# EAGLE schematic Schematic3 (EAGLE 6.5.0)
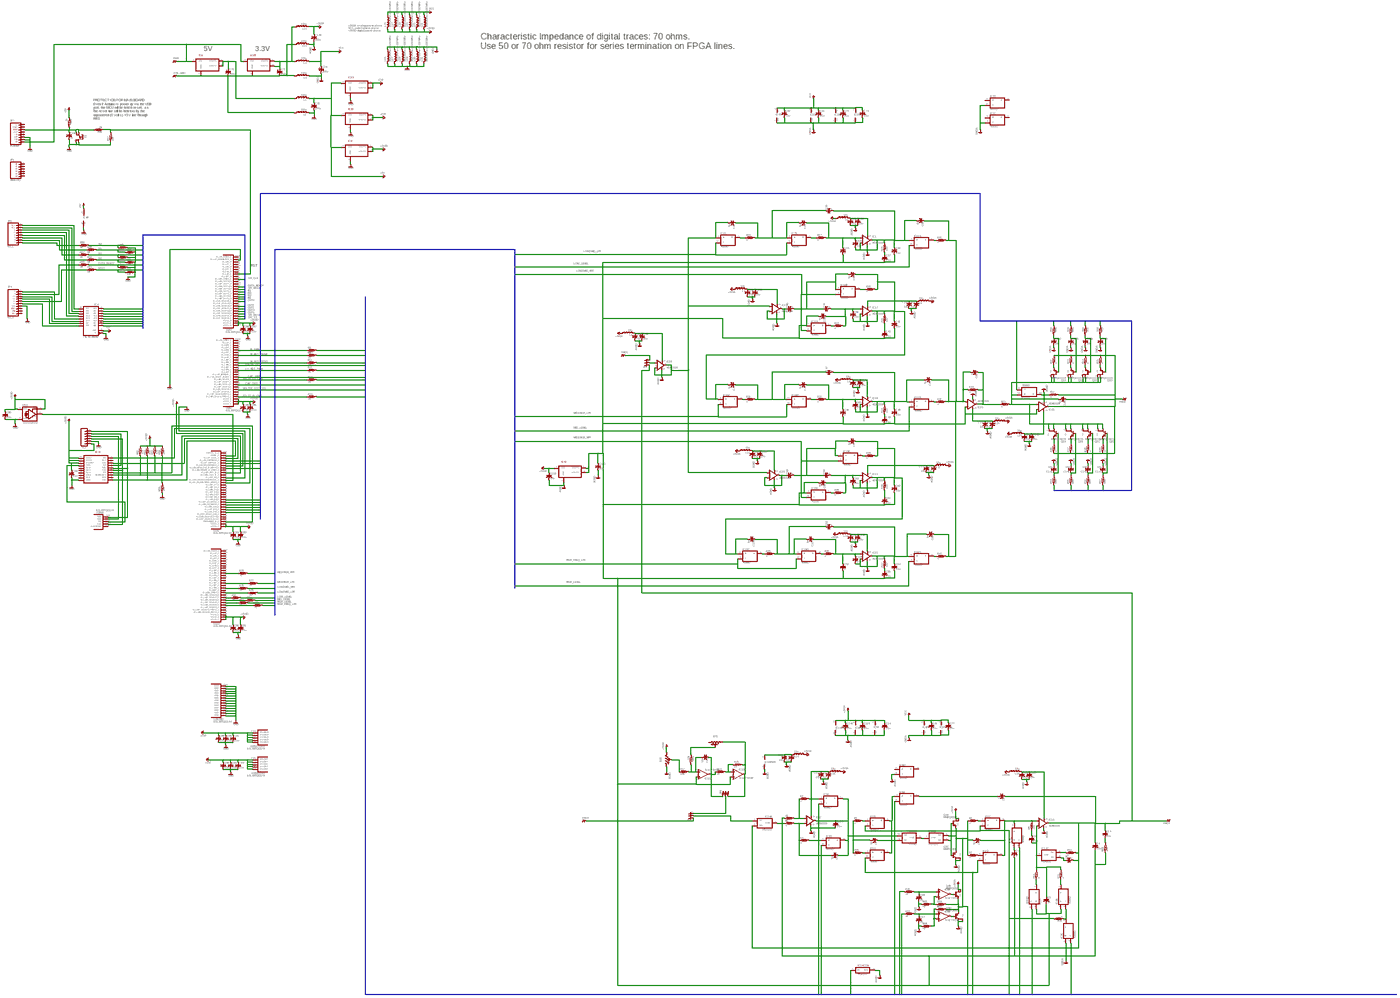
[diagram p0: schematic, sheet 1, overview]
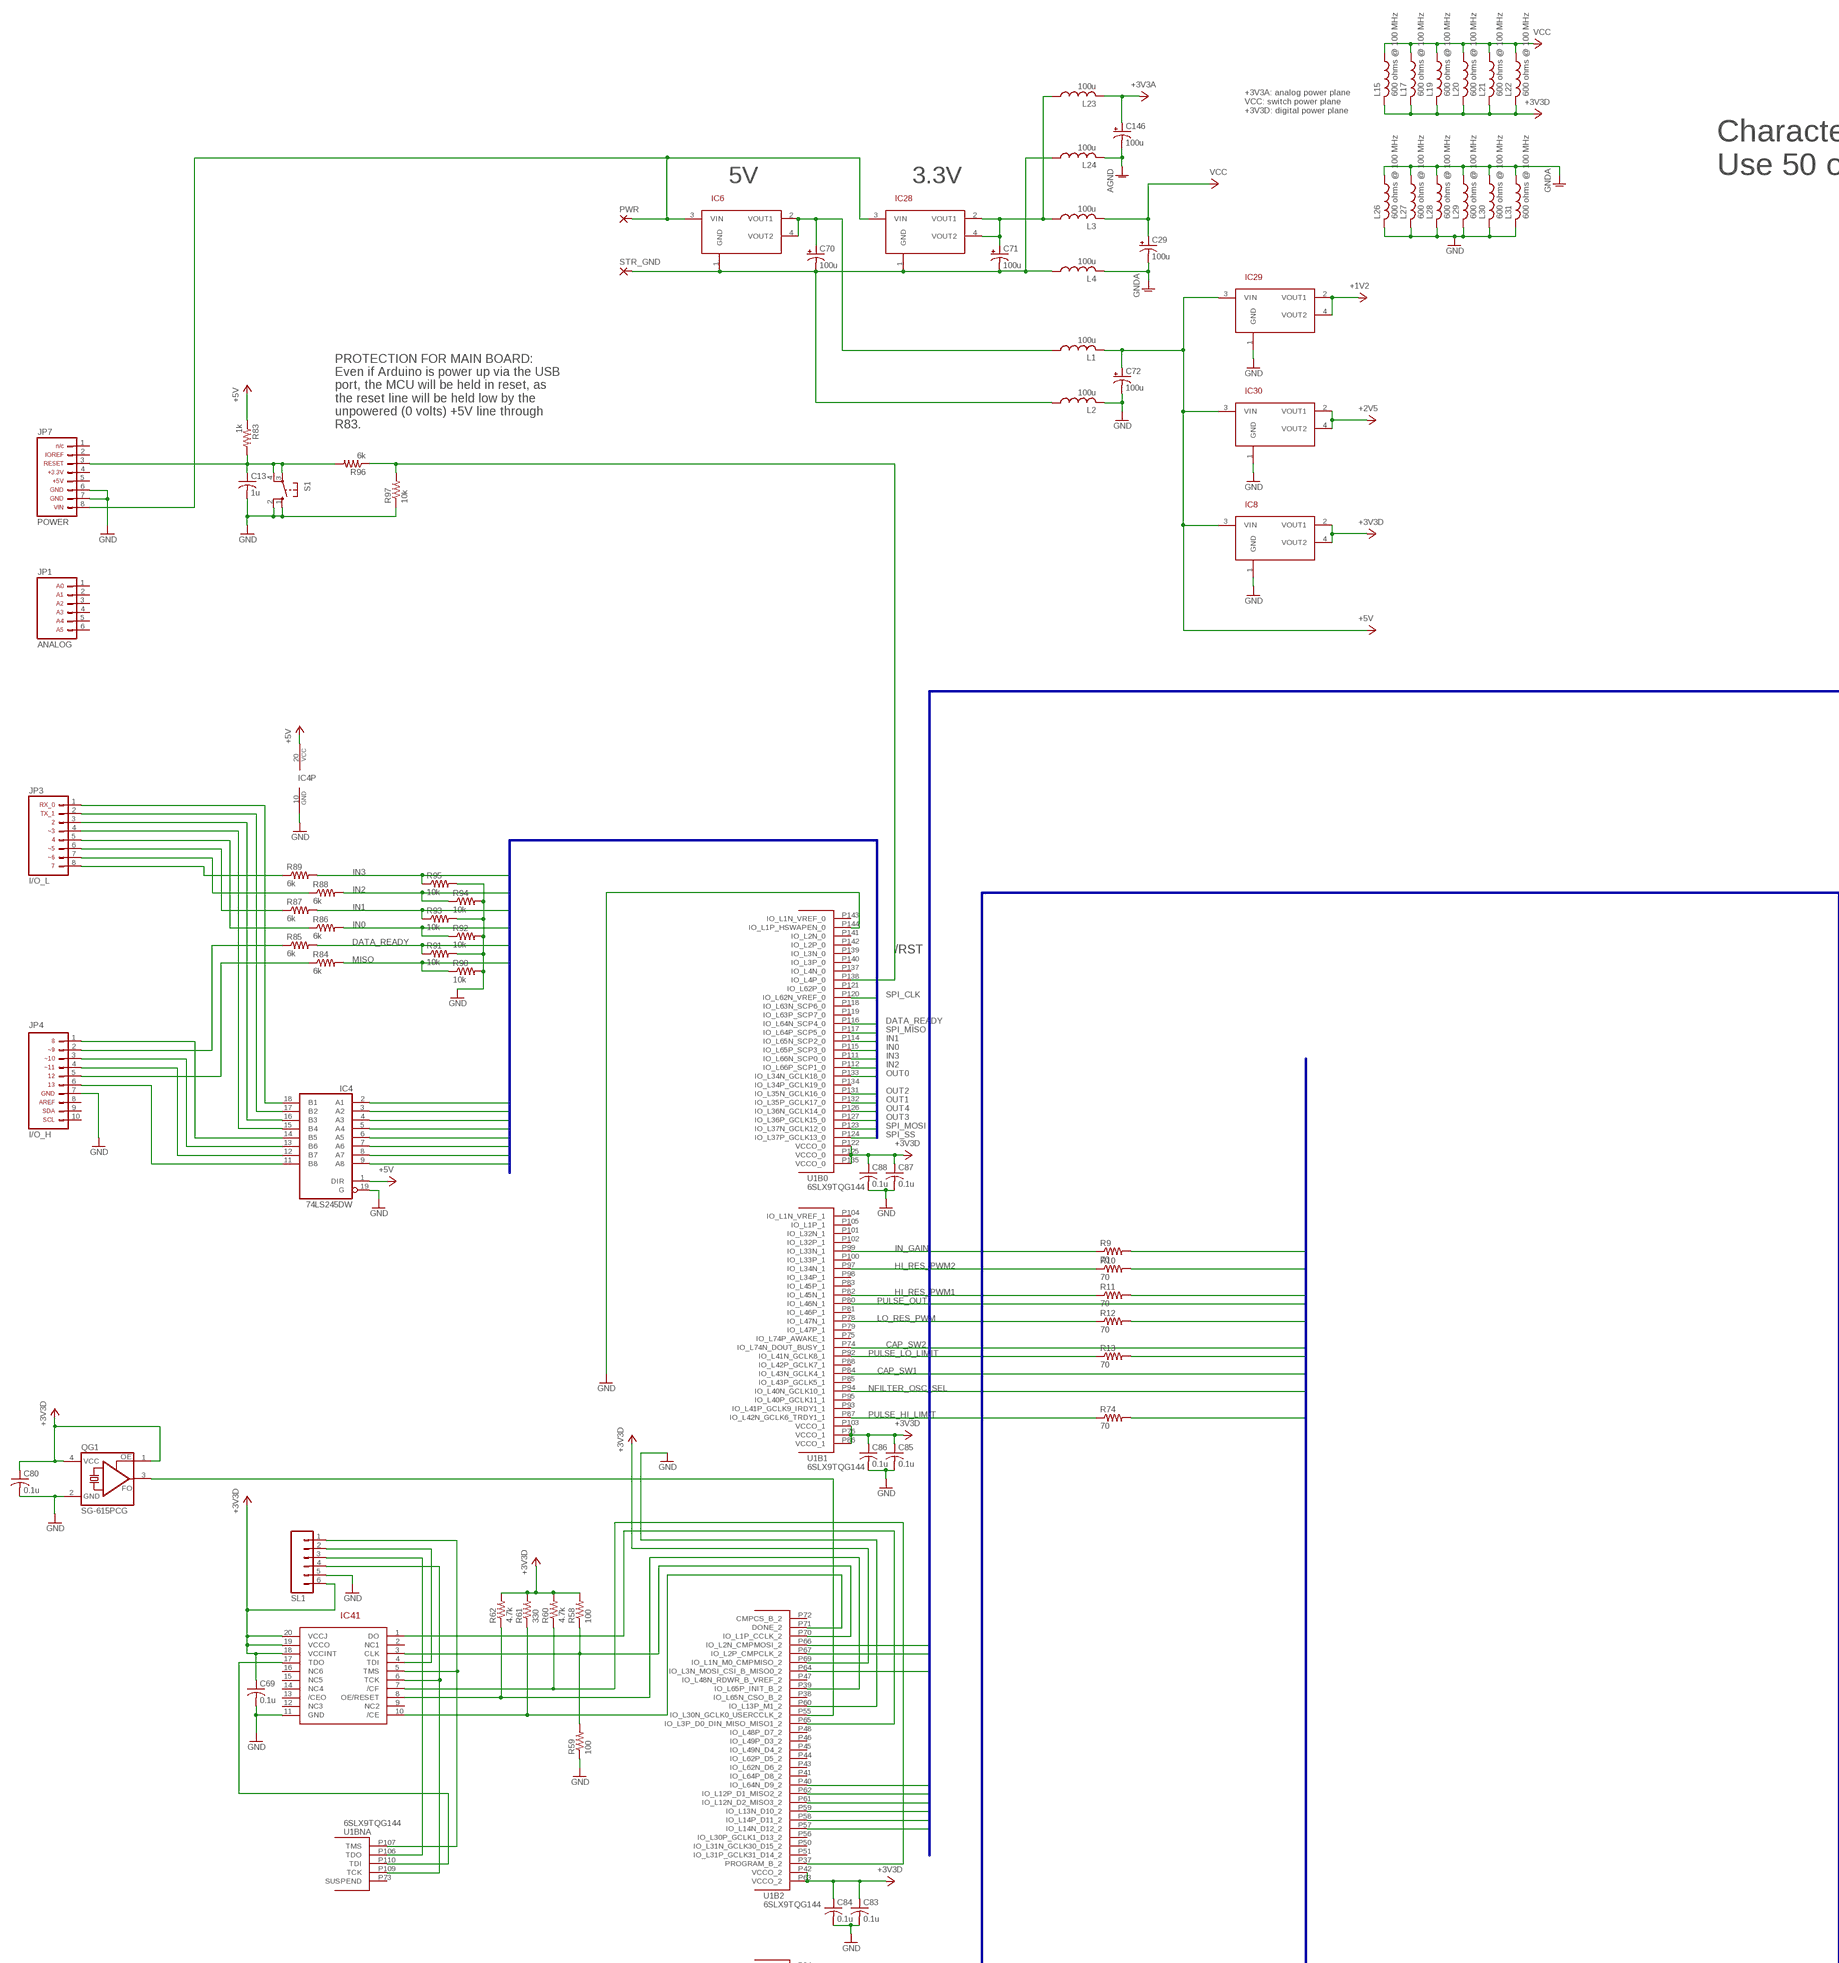
[diagram p1: schematic, sheet 1, part 1 of 6]
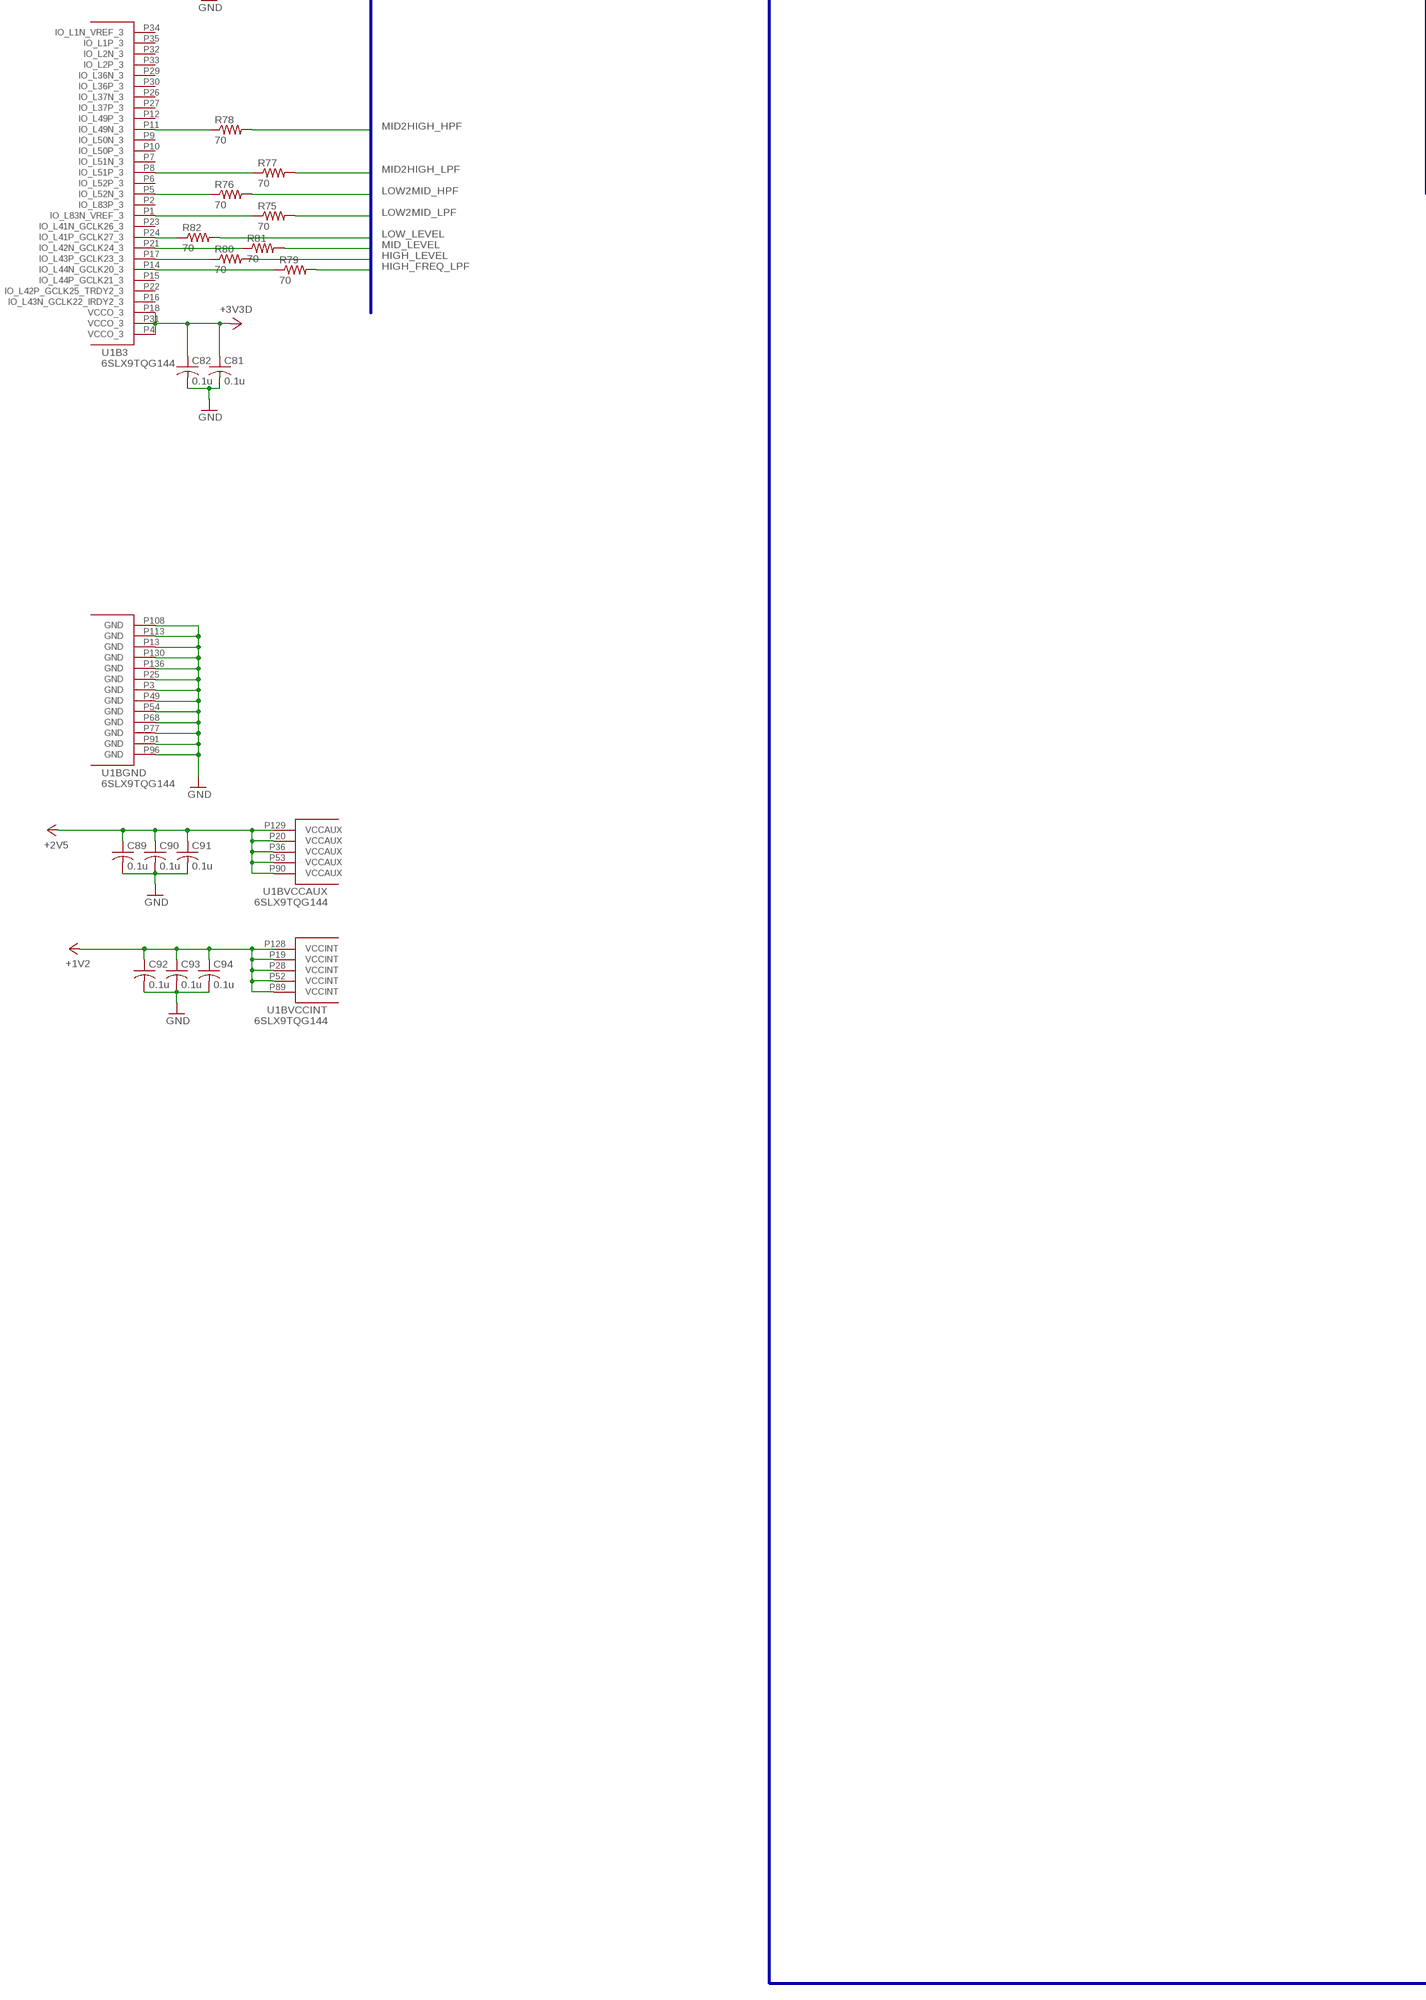
[diagram p2: schematic, sheet 1, part 2 of 6]
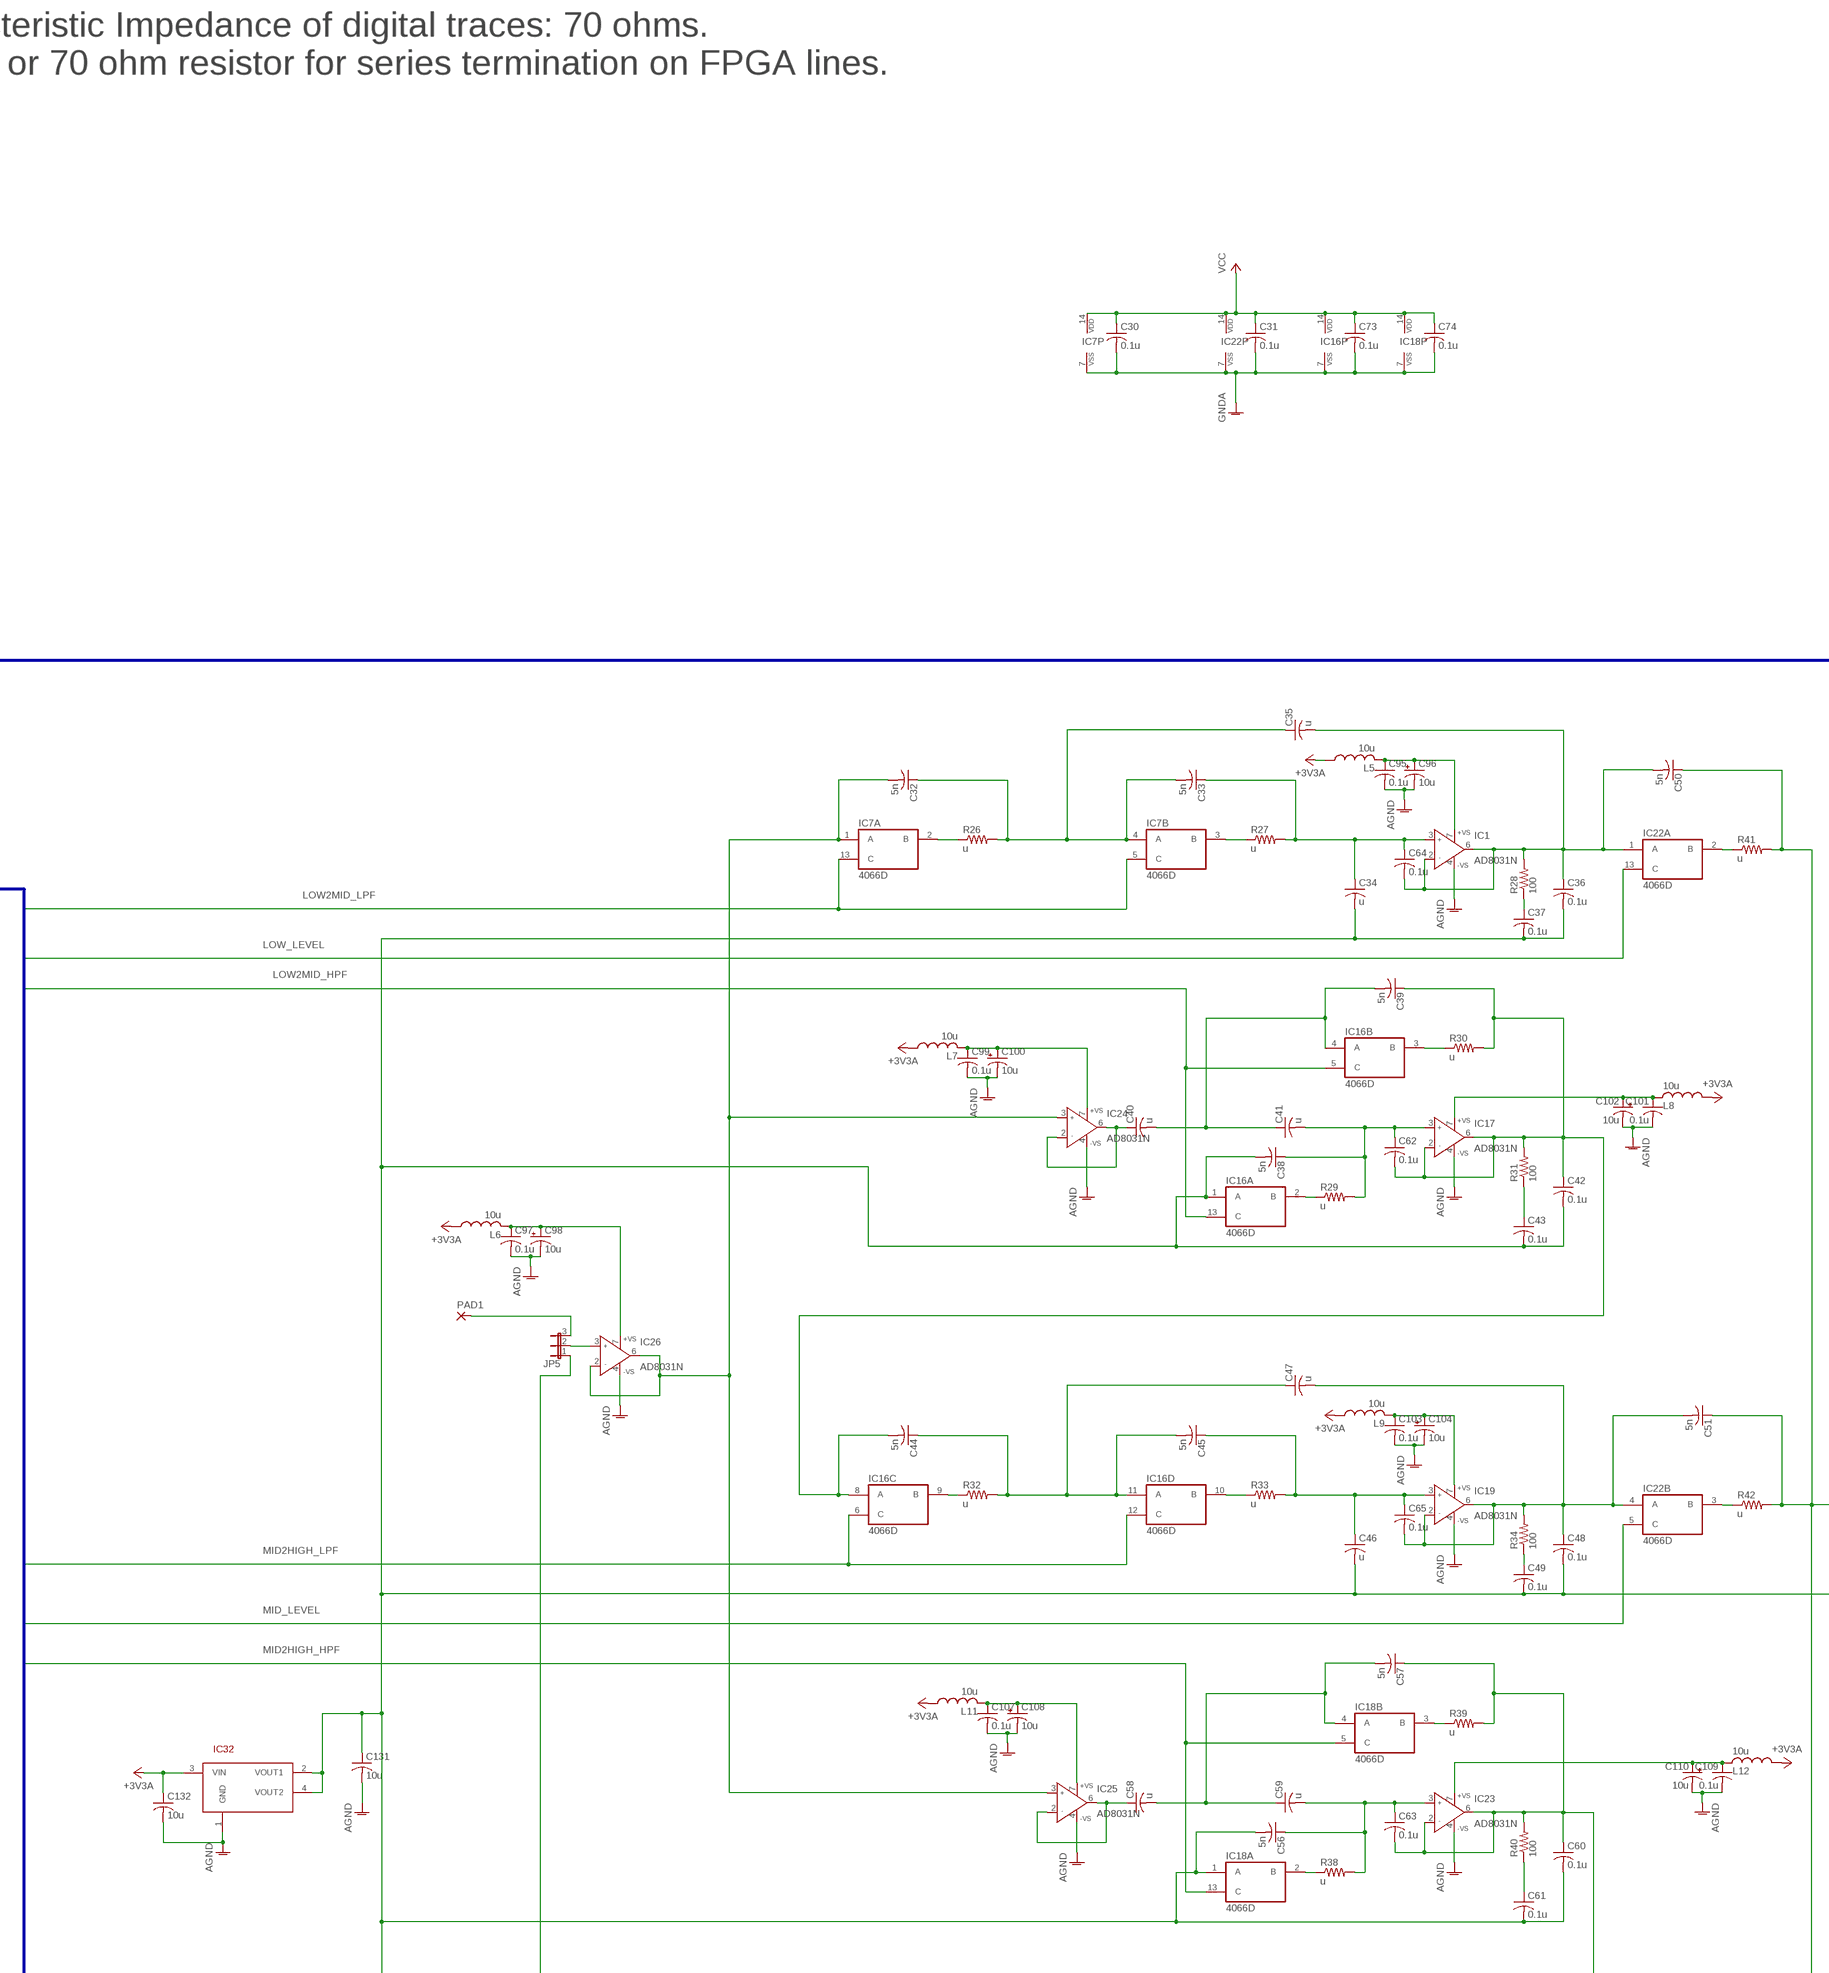
[diagram p3: schematic, sheet 1, part 3 of 6]
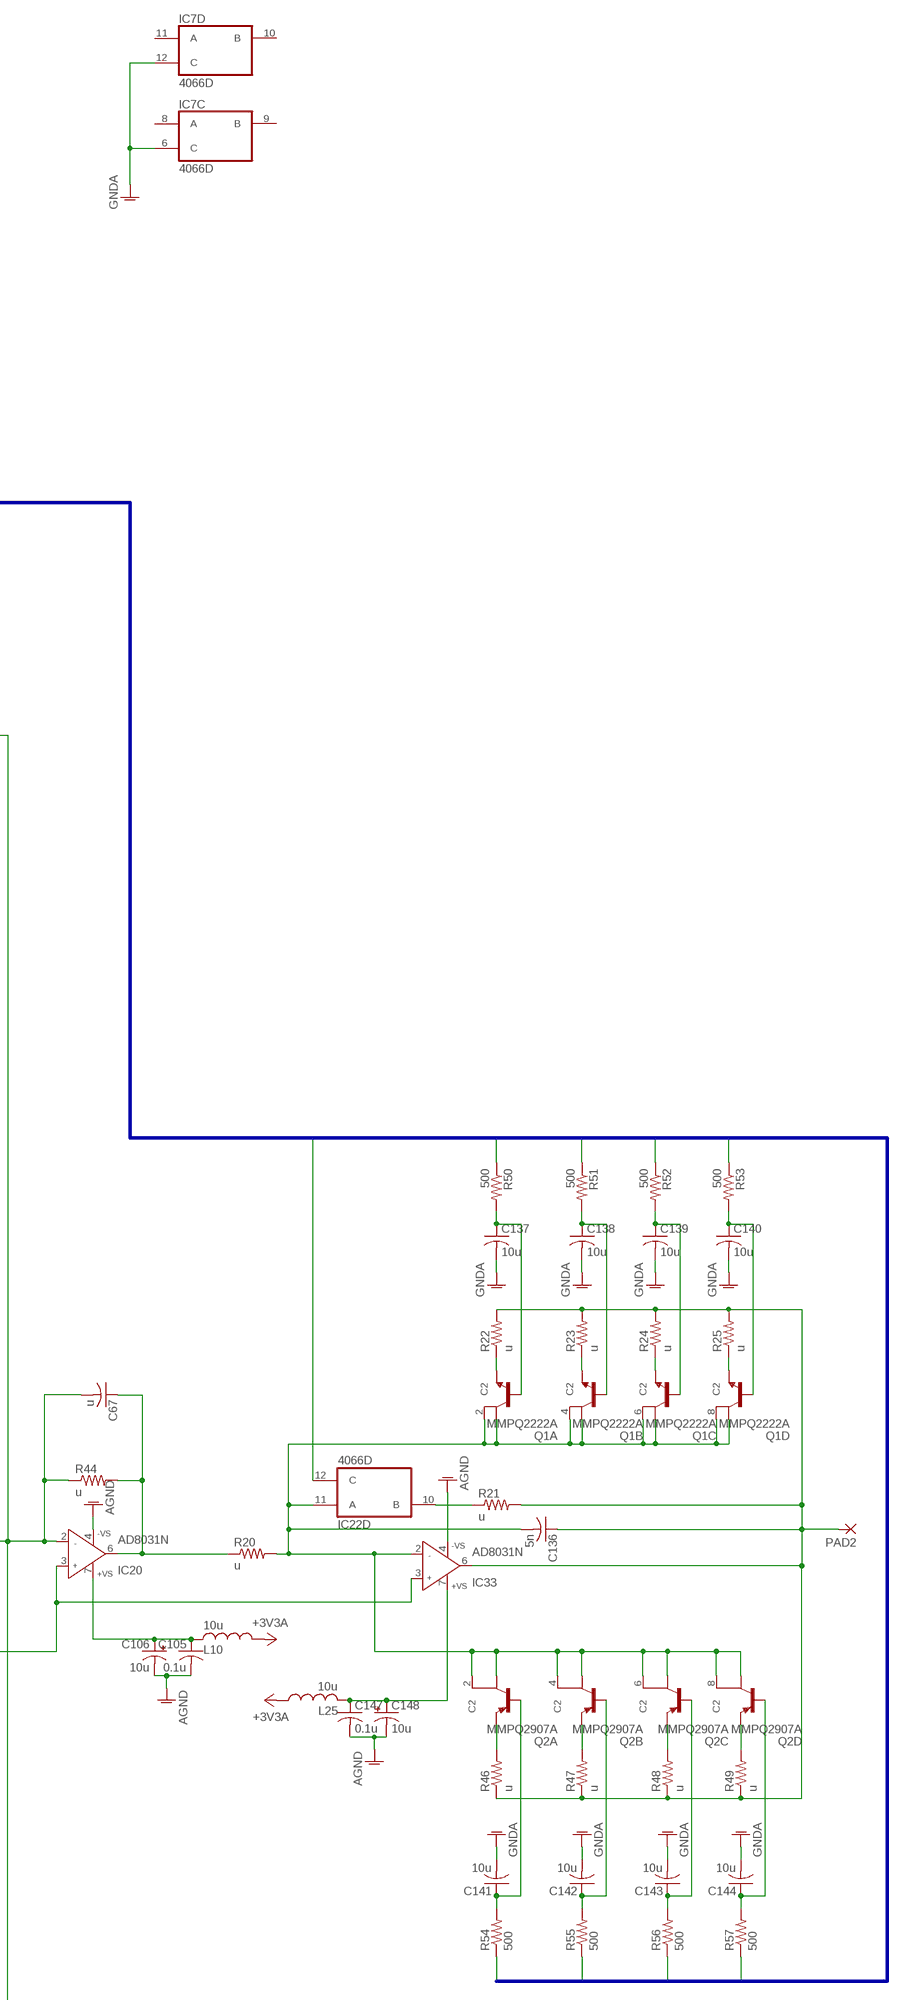
[diagram p4: schematic, sheet 1, part 4 of 6]
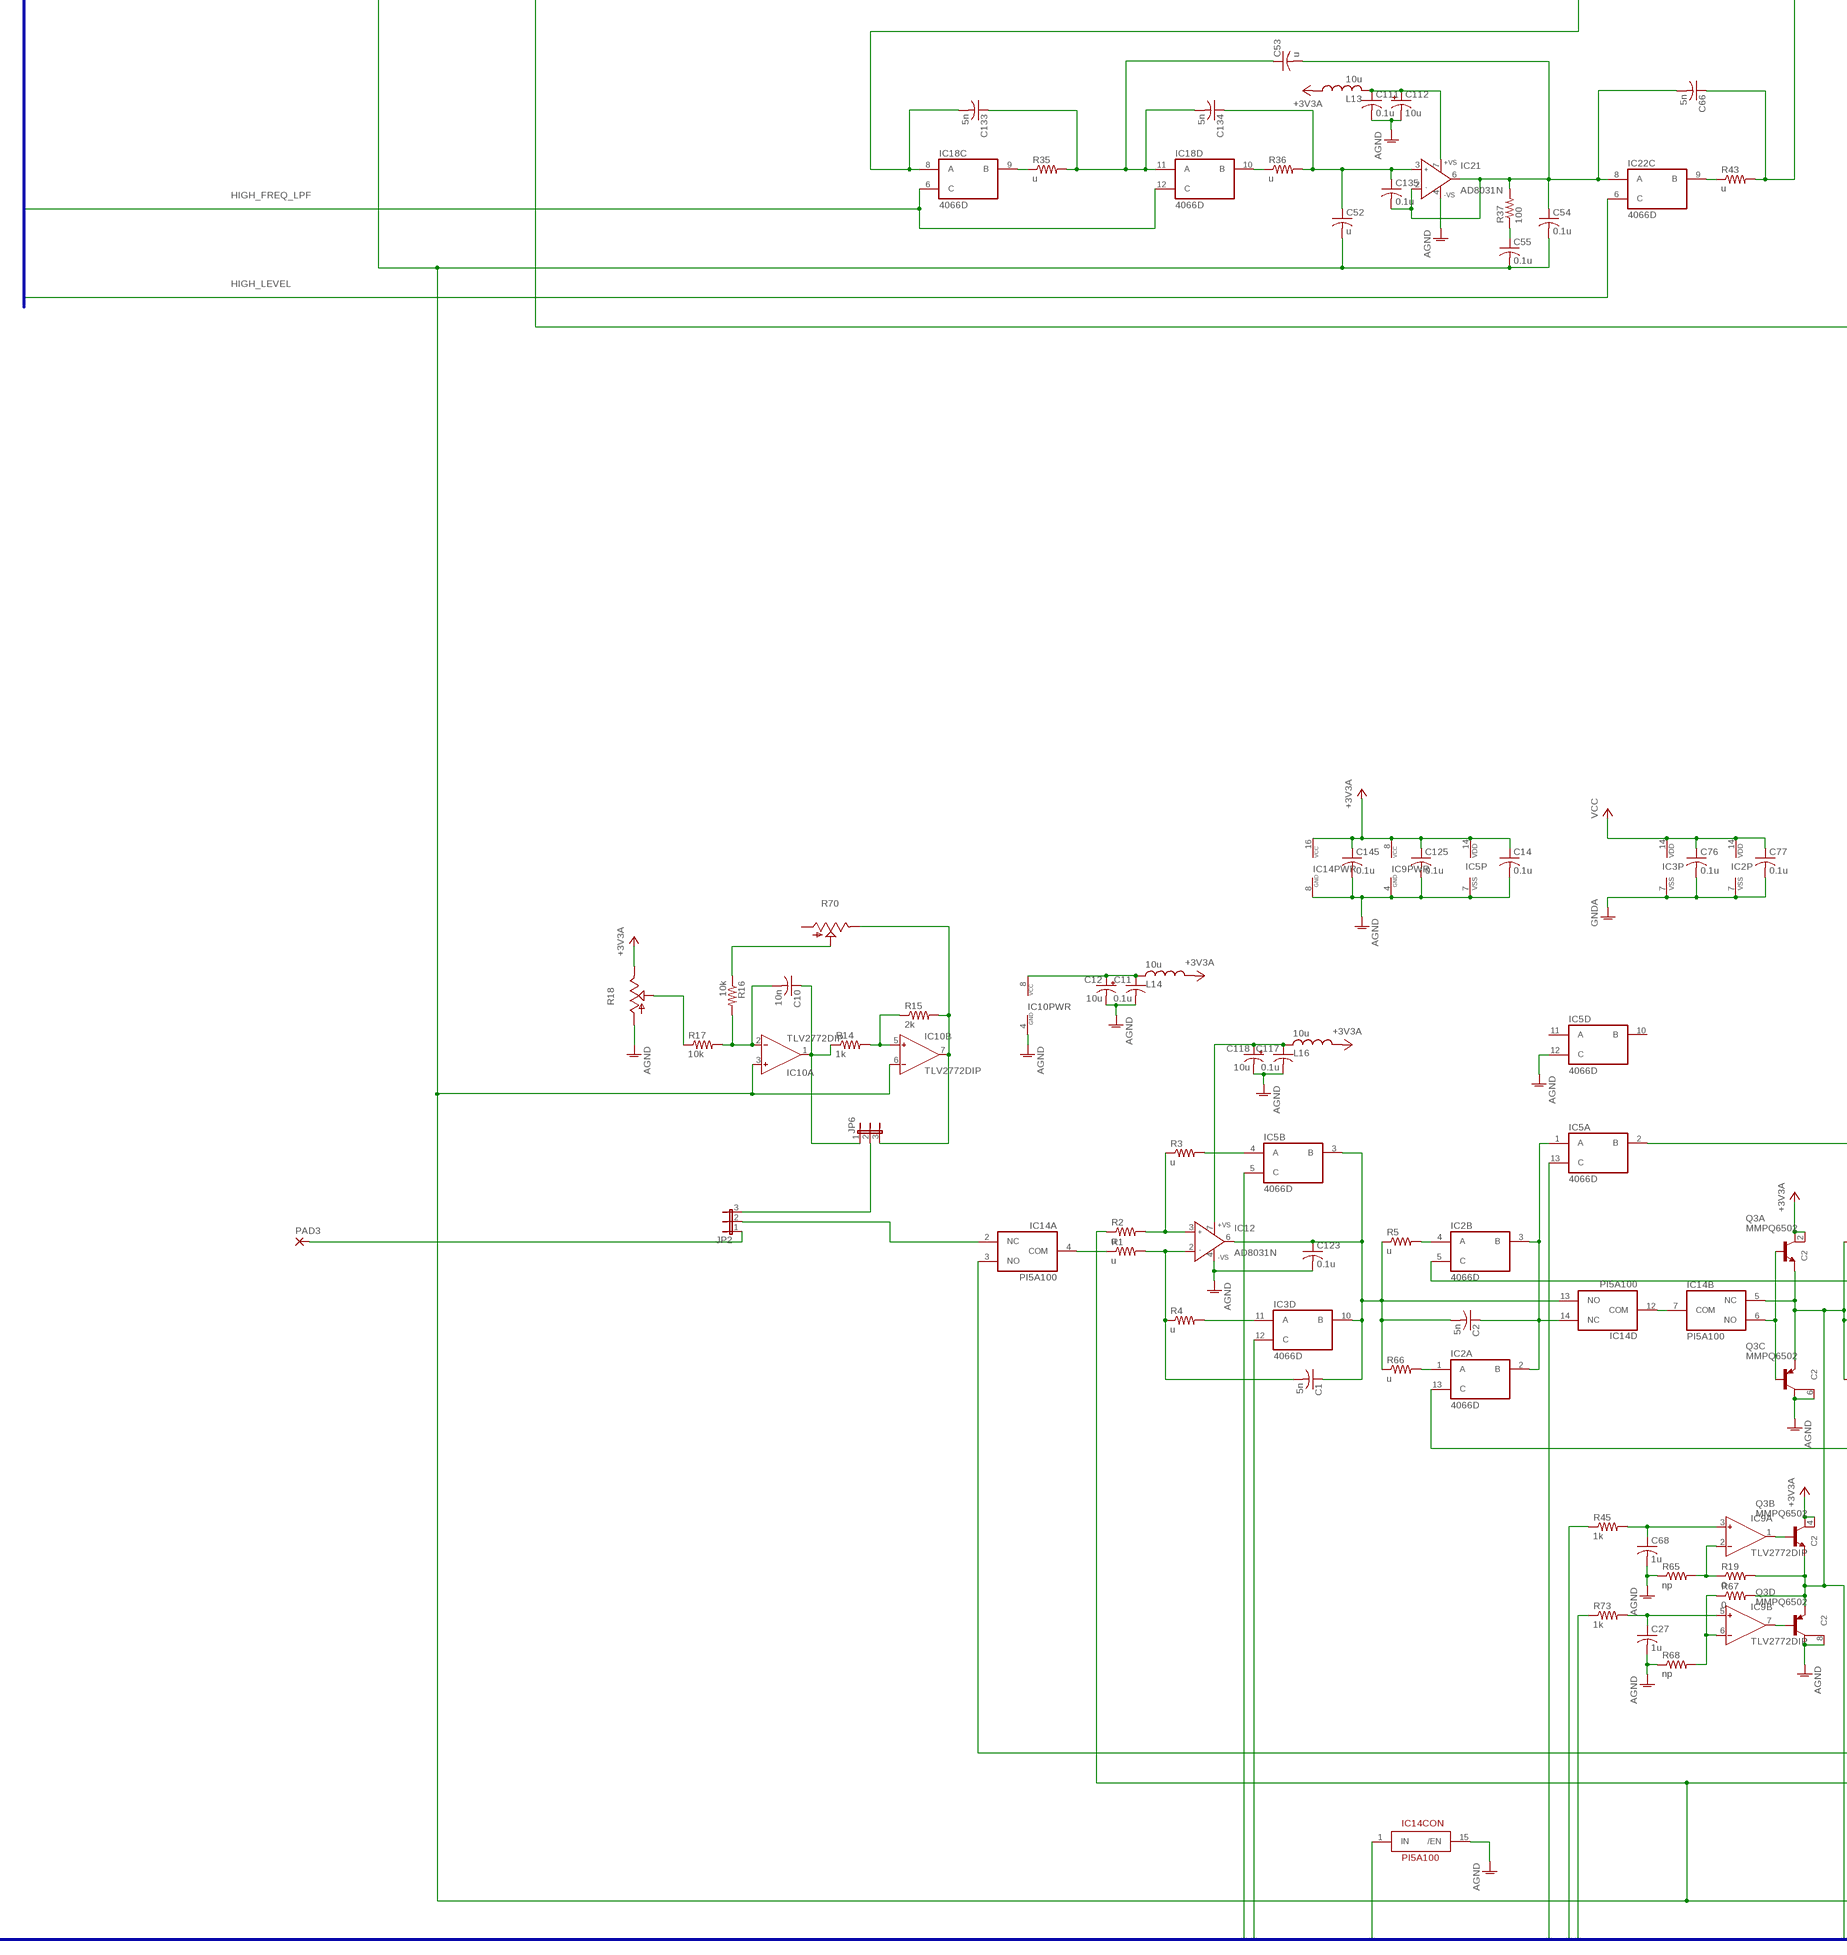
[diagram p5: schematic, sheet 1, part 5 of 6]
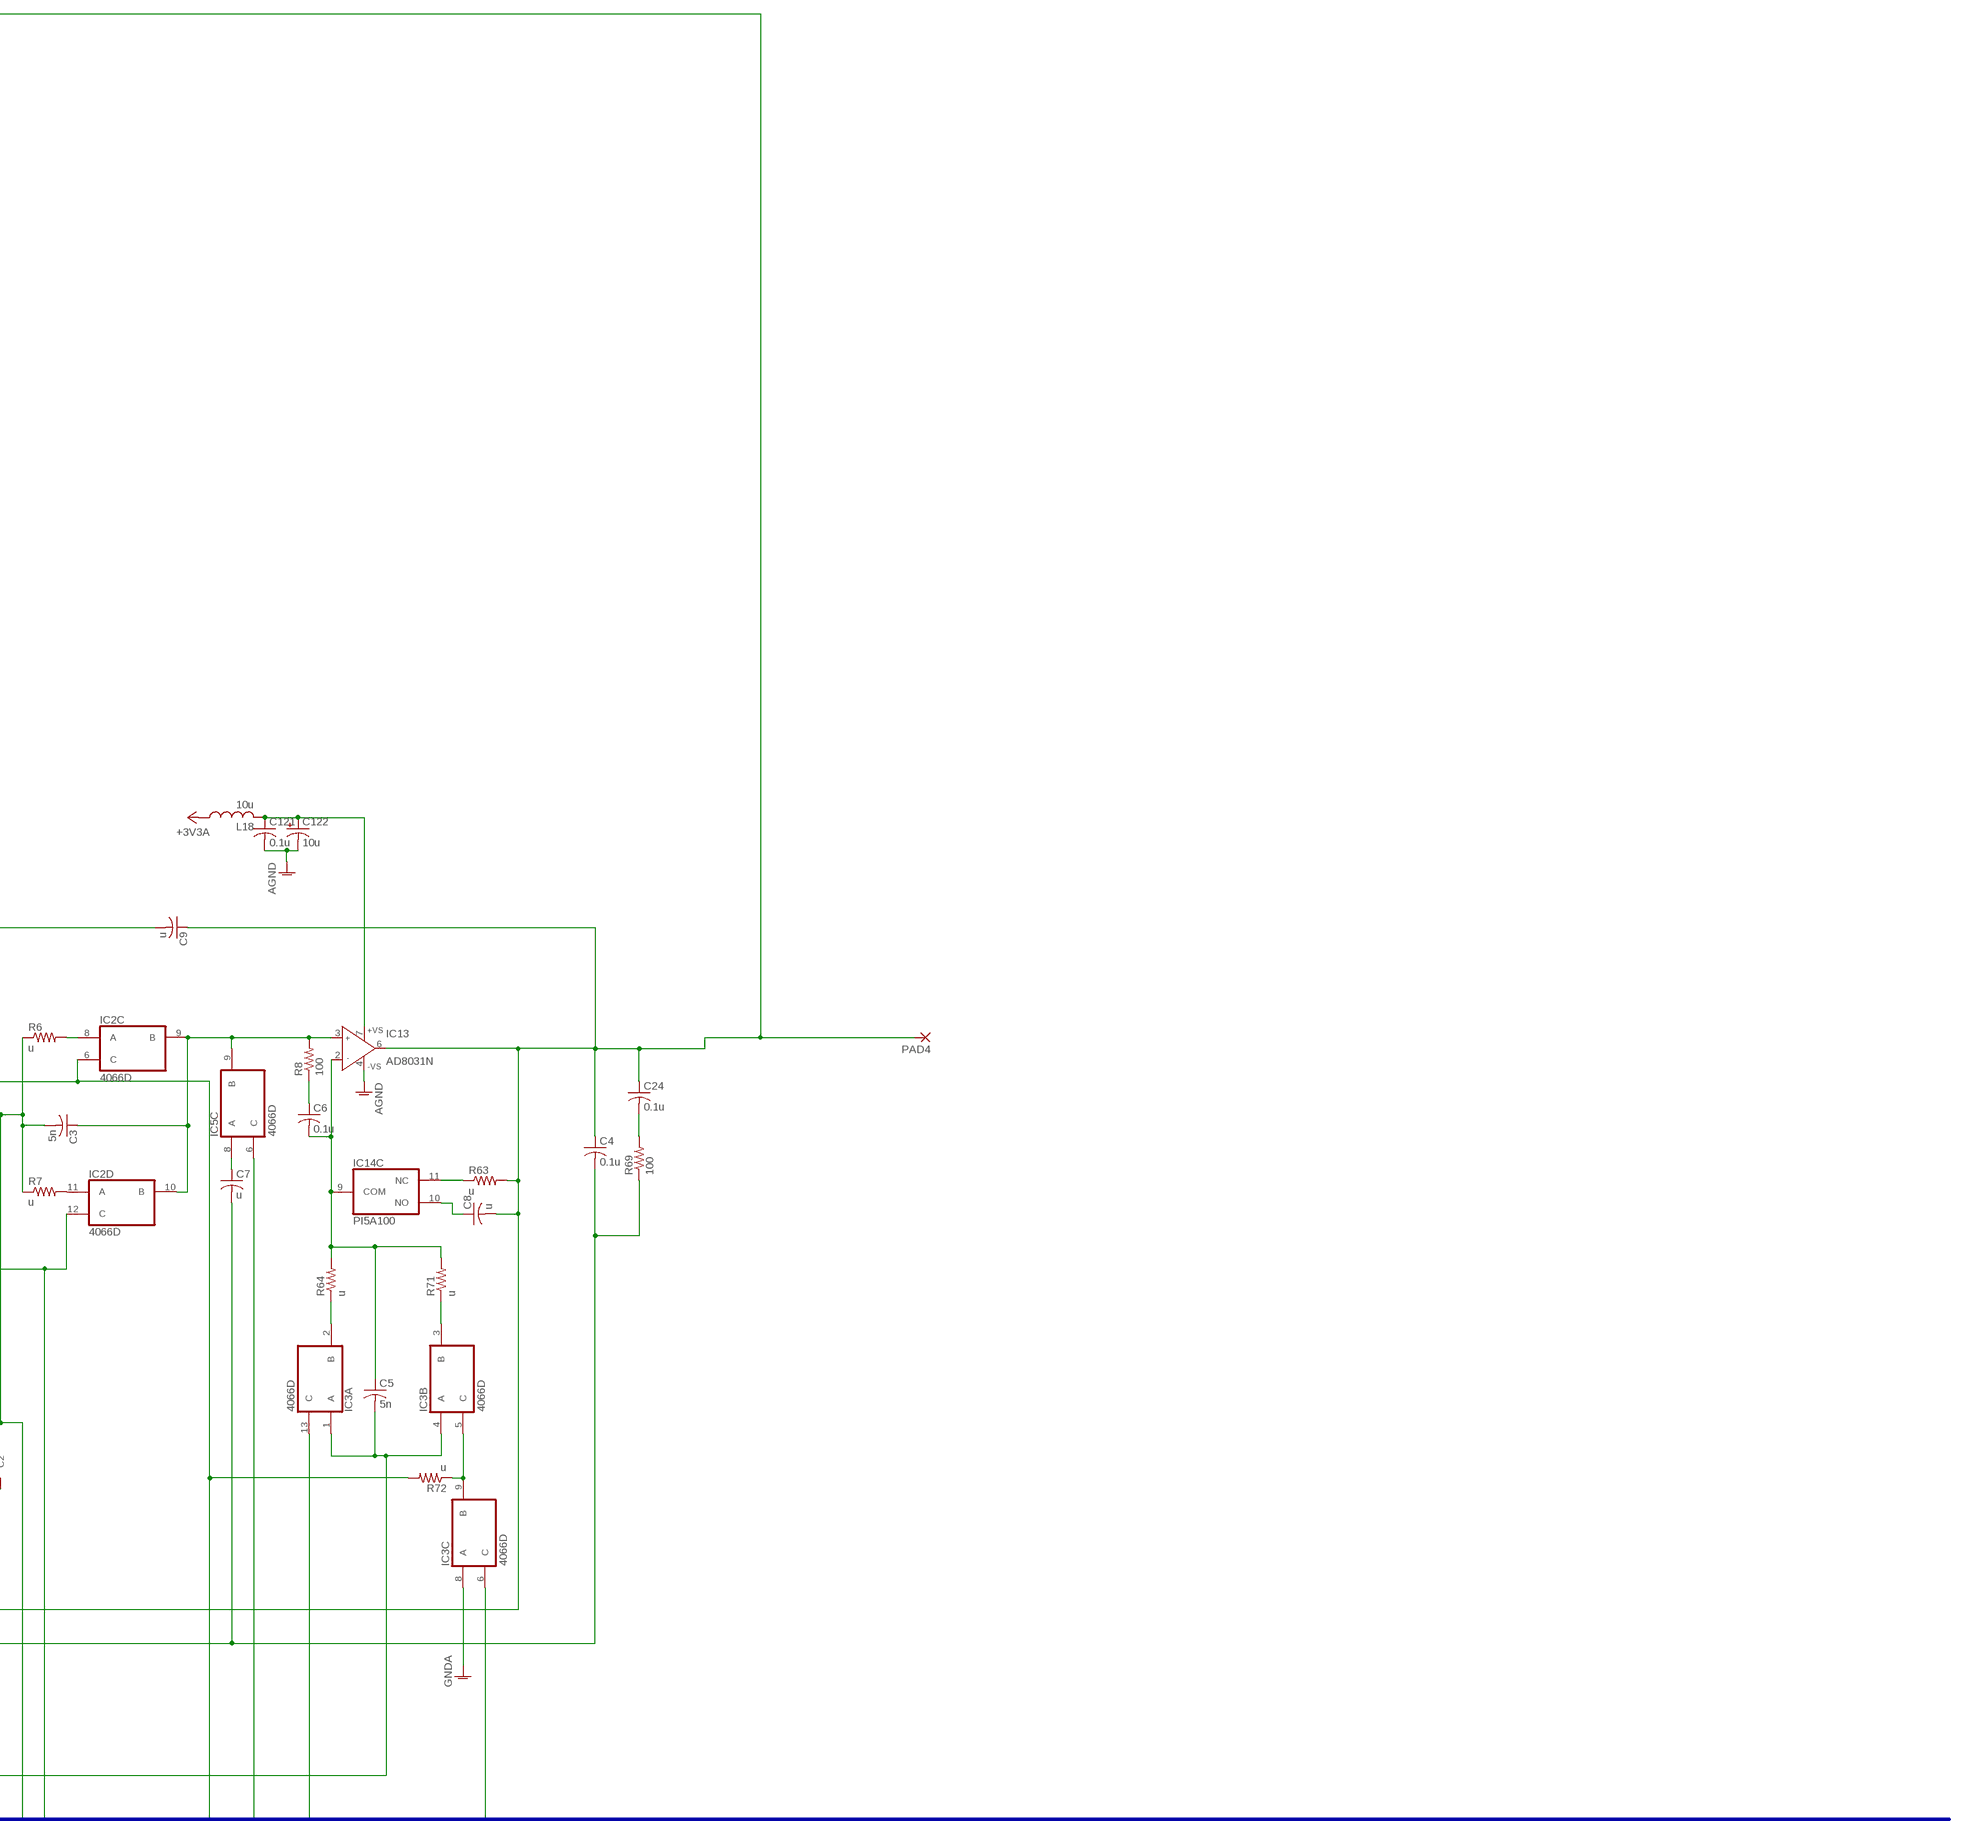
[diagram p6: schematic, sheet 1, part 6 of 6]

## Parts
C1  5n  C-US050-035X075  [C050-035X075]
C2  5n  C-US050-035X075  [C050-035X075]
C3  5n  C-US050-035X075  [C050-035X075]
C4  0.1u  C-US050-035X075  [C050-035X075]
C5  5n  C-US050-035X075  [C050-035X075]
C6  0.1u  C-US050-035X075  [C050-035X075]
C7  u  C-US050-035X075  [C050-035X075]
C8  u  C-US050-035X075  [C050-035X075]
C9  u  C-US050-035X075  [C050-035X075]
C10  10n  C-US050-035X075  [C050-035X075]
C11  0.1u  C-USC0805  [C0805]
C12  10u  CPOL-USA/3216-18R  [A/3216-18R]
C13  1u  C-USC0805  [C0805]
C14  0.1u  C-USC0805  [C0805]
C24  0.1u  C-US050-035X075  [C050-035X075]
C27  1u  C-USC0805  [C0805]
C29  100u  CPOL-USB/3528-21R  [B/3528-21R]
C30  0.1u  C-USC0805  [C0805]
C31  0.1u  C-USC0805  [C0805]
C32  5n  C-US050-035X075  [C050-035X075]
C33  5n  C-US050-035X075  [C050-035X075]
C34  u  C-US050-035X075  [C050-035X075]
C35  u  C-US050-035X075  [C050-035X075]
C36  0.1u  C-US050-035X075  [C050-035X075]
C37  0.1u  C-US050-035X075  [C050-035X075]
C38  5n  C-US050-035X075  [C050-035X075]
C39  5n  C-US050-035X075  [C050-035X075]
C40  u  C-US050-035X075  [C050-035X075]
C41  u  C-US050-035X075  [C050-035X075]
C42  0.1u  C-US050-035X075  [C050-035X075]
C43  0.1u  C-US050-035X075  [C050-035X075]
C44  5n  C-US050-035X075  [C050-035X075]
C45  5n  C-US050-035X075  [C050-035X075]
C46  u  C-US050-035X075  [C050-035X075]
C47  u  C-US050-035X075  [C050-035X075]
C48  0.1u  C-US050-035X075  [C050-035X075]
C49  0.1u  C-US050-035X075  [C050-035X075]
C50  5n  C-US050-035X075  [C050-035X075]
C51  5n  C-US050-035X075  [C050-035X075]
C52  u  C-US050-035X075  [C050-035X075]
C53  u  C-US050-035X075  [C050-035X075]
C54  0.1u  C-US050-035X075  [C050-035X075]
C55  0.1u  C-US050-035X075  [C050-035X075]
C56  5n  C-US050-035X075  [C050-035X075]
C57  5n  C-US050-035X075  [C050-035X075]
C58  u  C-US050-035X075  [C050-035X075]
C59  u  C-US050-035X075  [C050-035X075]
C60  0.1u  C-US050-035X075  [C050-035X075]
C61  0.1u  C-US050-035X075  [C050-035X075]
C62  0.1u  C-US050-035X075  [C050-035X075]
C63  0.1u  C-US050-035X075  [C050-035X075]
C64  0.1u  C-US050-035X075  [C050-035X075]
C65  0.1u  C-US050-035X075  [C050-035X075]
C66  5n  C-US050-035X075  [C050-035X075]
C67  u  C-US050-035X075  [C050-035X075]
C68  1u  C-USC0805  [C0805]
C69  0.1u  C-USC0805  [C0805]
C70  100u  CPOL-USCT3528  [CT3528]
C71  100u  CPOL-USCT3528  [CT3528]
C72  100u  CPOL-USB/3528-21R  [B/3528-21R]
C73  0.1u  C-USC0805  [C0805]
C74  0.1u  C-USC0805  [C0805]
C76  0.1u  C-USC0805  [C0805]
C77  0.1u  C-USC0805  [C0805]
C80  0.1u  C-USC0805  [C0805]
C81  0.1u  C-USC0805  [C0805]
C82  0.1u  C-USC0805  [C0805]
C83  0.1u  C-USC0805  [C0805]
C84  0.1u  C-USC0805  [C0805]
C85  0.1u  C-USC0805  [C0805]
C86  0.1u  C-USC0805  [C0805]
C87  0.1u  C-USC0805  [C0805]
C88  0.1u  C-USC0805  [C0805]
C89  0.1u  C-USC0805  [C0805]
C90  0.1u  C-USC0805  [C0805]
C91  0.1u  C-USC0805  [C0805]
C92  0.1u  C-USC0805  [C0805]
C93  0.1u  C-USC0805  [C0805]
C94  0.1u  C-USC0805  [C0805]
C95  0.1u  C-USC0805  [C0805]
C96  10u  CPOL-USA/3216-18R  [A/3216-18R]
C97  0.1u  C-USC0805  [C0805]
C98  10u  CPOL-USA/3216-18R  [A/3216-18R]
C99  0.1u  C-USC0805  [C0805]
C100  10u  CPOL-USA/3216-18R  [A/3216-18R]
C101  0.1u  C-USC0805  [C0805]
C102  10u  CPOL-USA/3216-18R  [A/3216-18R]
C103  0.1u  C-USC0805  [C0805]
C104  10u  CPOL-USA/3216-18R  [A/3216-18R]
C105  0.1u  C-USC0805  [C0805]
C106  10u  CPOL-USA/3216-18R  [A/3216-18R]
C107  0.1u  C-USC0805  [C0805]
C108  10u  CPOL-USA/3216-18R  [A/3216-18R]
C109  0.1u  C-USC0805  [C0805]
C110  10u  CPOL-USA/3216-18R  [A/3216-18R]
C111  0.1u  C-USC0805  [C0805]
C112  10u  CPOL-USA/3216-18R  [A/3216-18R]
C117  0.1u  C-USC0805  [C0805]
C118  10u  CPOL-USA/3216-18R  [A/3216-18R]
C121  0.1u  C-USC0805  [C0805]
C122  10u  CPOL-USA/3216-18R  [A/3216-18R]
C123  0.1u  C-US050-035X075  [C050-035X075]
C125  0.1u  C-USC0805  [C0805]
C131  10u  C-USC0805  [C0805]
C132  10u  C-USC0805  [C0805]
C133  5n  C-US050-035X075  [C050-035X075]
C134  5n  C-US050-035X075  [C050-035X075]
C135  0.1u  C-US050-035X075  [C050-035X075]
C136  5n  C-US050-035X075  [C050-035X075]
C137  10u  C-US050-035X075  [C050-035X075]
C138  10u  C-US050-035X075  [C050-035X075]
C139  10u  C-US050-035X075  [C050-035X075]
C140  10u  C-US050-035X075  [C050-035X075]
C141  10u  C-US050-035X075  [C050-035X075]
C142  10u  C-US050-035X075  [C050-035X075]
C143  10u  C-US050-035X075  [C050-035X075]
C144  10u  C-US050-035X075  [C050-035X075]
C145  0.1u  C-USC0805  [C0805]
C146  100u  CPOL-USB/3528-21R  [B/3528-21R]
C147  0.1u  C-USC0805  [C0805]
C148  10u  CPOL-USA/3216-18R  [A/3216-18R]
IC1  AD8031N  [DIL08]
IC2  4066D  [SO14]
IC3  4066D  [SO14]
IC4  74LS245DW  [SO20W]
IC5  4066D  [SO14]
IC6  TLV1117  [SOT223-4]
IC7  4066D  [SO14]
IC8  TLV1117  [SOT223-4]
IC9  TLV2772DIP  [DIL08]
IC10  TLV2772DIP  [DIL08]
IC12  AD8031N  [DIL08]
IC13  AD8031N  [DIL08]
IC14  PI5A100  [SO-16]
IC16  4066D  [SO14]
IC17  AD8031N  [DIL08]
IC18  4066D  [SO14]
IC19  AD8031N  [DIL08]
IC20  AD8031N  [DIL08]
IC21  AD8031N  [DIL08]
IC22  4066D  [SO14]
IC23  AD8031N  [DIL08]
IC24  AD8031N  [DIL08]
IC25  AD8031N  [DIL08]
IC26  AD8031N  [DIL08]
IC28  TLV1117  [SOT223-4]
IC29  TLV1117  [SOT223-4]
IC30  TLV1117  [SOT223-4]
IC32  TLV1117  [SOT223-4]
IC33  AD8031N  [DIL08]
IC41  XCFXXS  [TSSOP20]
JP1  ARDUINO_CONN-ANALOGSIP  [CONN-1X06]
JP2  JP2E  [JP2]
JP3  ARDUINO_CONN-IO_LSIP  [CONN-1X08]
JP4  ARDUINO_CONN-IO_HSIP  [CONN-1X10]
JP5  JP2E  [JP2]
JP6  JP2E  [JP2]
JP7  ARDUINO_CONN-POWERSIP  [CONN-1X08]
L1  100u  L-USL5650M  [L5650M]
L2  100u  L-USL5650M  [L5650M]
L3  100u  L-USL5650M  [L5650M]
L4  100u  L-USL5650M  [L5650M]
L5  10u  L-USL0805  [L0805]
L6  10u  L-USL0805  [L0805]
L7  10u  L-USL0805  [L0805]
L8  10u  L-USL0805  [L0805]
L9  10u  L-USL0805  [L0805]
L10  10u  L-USL0805  [L0805]
L11  10u  L-USL0805  [L0805]
L12  10u  L-USL0805  [L0805]
L13  10u  L-USL0805  [L0805]
L14  10u  L-USL0805  [L0805]
L15  600 ohms @ 100 MHz  L-USL0805  [L0805]
L16  10u  L-USL0805  [L0805]
L17  600 ohms @ 100 MHz  L-USL0805  [L0805]
L18  10u  L-USL0805  [L0805]
L19  600 ohms @ 100 MHz  L-USL0805  [L0805]
L20  600 ohms @ 100 MHz  L-USL0805  [L0805]
L21  600 ohms @ 100 MHz  L-USL0805  [L0805]
L22  600 ohms @ 100 MHz  L-USL0805  [L0805]
L23  100u  L-USL5650M  [L5650M]
L24  100u  L-USL5650M  [L5650M]
L25  10u  L-USL0805  [L0805]
L26  600 ohms @ 100 MHz  L-USL0805  [L0805]
L27  600 ohms @ 100 MHz  L-USL0805  [L0805]
L28  600 ohms @ 100 MHz  L-USL0805  [L0805]
L29  600 ohms @ 100 MHz  L-USL0805  [L0805]
L30  600 ohms @ 100 MHz  L-USL0805  [L0805]
L31  600 ohms @ 100 MHz  L-USL0805  [L0805]
PAD1  2,54/1,1  [2,54/1,1]
PAD2  2,54/1,1  [2,54/1,1]
PAD3  2,54/1,1  [2,54/1,1]
PAD4  2,54/1,1  [2,54/1,1]
PWR  2,54/1,1  [2,54/1,1]
Q1  MMPQ2222A  [SO16]
Q2  MMPQ2907A  [SO16]
Q3  MMPQ6502  [SO16]
QG1  SG-615PCG  [SG-615]
R1  u  R-US_0207/10  [0207/10]
R2  u  R-US_0207/10  [0207/10]
R3  u  R-US_0207/10  [0207/10]
R4  u  R-US_0207/10  [0207/10]
R5  u  R-US_0207/10  [0207/10]
R6  u  R-US_0207/10  [0207/10]
R7  u  R-US_0207/10  [0207/10]
R8  100  R-US_0207/10  [0207/10]
R9  70  R-US_R0805  [R0805]
R10  70  R-US_R0805  [R0805]
R11  70  R-US_R0805  [R0805]
R12  70  R-US_R0805  [R0805]
R13  70  R-US_R0805  [R0805]
R14  1k  R-US_0207/10  [0207/10]
R15  2k  R-US_0207/10  [0207/10]
R16  10k  R-US_0207/10  [0207/10]
R17  10k  R-US_0207/10  [0207/10]
R18  TRIM_US-CT6  [CT6]
R19  0  R-US_R0805  [R0805]
R20  u  R-US_0207/10  [0207/10]
R21  u  R-US_0207/10  [0207/10]
R22  u  R-US_0207/10  [0207/10]
R23  u  R-US_0207/10  [0207/10]
R24  u  R-US_0207/10  [0207/10]
R25  u  R-US_0207/10  [0207/10]
R26  u  R-US_0207/10  [0207/10]
R27  u  R-US_0207/10  [0207/10]
R28  100  R-US_0207/10  [0207/10]
R29  u  R-US_0207/10  [0207/10]
R30  u  R-US_0207/10  [0207/10]
R31  100  R-US_0207/10  [0207/10]
R32  u  R-US_0204/7  [0204/7]
R33  u  R-US_0204/7  [0204/7]
R34  100  R-US_0207/10  [0207/10]
R35  u  R-US_0207/10  [0207/10]
R36  u  R-US_0207/10  [0207/10]
R37  100  R-US_0207/10  [0207/10]
R38  u  R-US_0207/10  [0207/10]
R39  u  R-US_0204/7  [0204/7]
R40  100  R-US_0207/10  [0207/10]
R41  u  R-US_0207/10  [0207/10]
R42  u  R-US_0207/10  [0207/10]
R43  u  R-US_0207/10  [0207/10]
R44  u  R-US_0207/10  [0207/10]
R45  1k  R-US_R0805  [R0805]
R46  u  R-US_0207/10  [0207/10]
R47  u  R-US_0207/10  [0207/10]
R48  u  R-US_0207/10  [0207/10]
R49  u  R-US_0207/10  [0207/10]
R50  500  R-US_0207/10  [0207/10]
R51  500  R-US_0207/10  [0207/10]
R52  500  R-US_0207/10  [0207/10]
R53  500  R-US_0207/10  [0207/10]
R54  500  R-US_0207/10  [0207/10]
R55  500  R-US_0207/10  [0207/10]
R56  500  R-US_0207/10  [0207/10]
R57  500  R-US_0207/10  [0207/10]
R58  100  R-US_M0805  [M0805]
R59  100  R-US_M0805  [M0805]
R60  4.7k  R-US_M0805  [M0805]
R61  330  R-US_M0805  [M0805]
R62  4.7k  R-US_M0805  [M0805]
R63  u  R-US_0207/10  [0207/10]
R64  u  R-US_0207/10  [0207/10]
R65  np  R-US_R0805  [R0805]
R66  u  R-US_0207/10  [0207/10]
R67  0  R-US_R0805  [R0805]
R68  np  R-US_R0805  [R0805]
R69  100  R-US_0207/10  [0207/10]
R70  TRIM_US-CT6  [CT6]
R71  u  R-US_0207/10  [0207/10]
R72  u  R-US_0207/10  [0207/10]
R73  1k  R-US_R0805  [R0805]
R74  70  R-US_R0805  [R0805]
R75  70  R-US_R0805  [R0805]
R76  70  R-US_R0805  [R0805]
R77  70  R-US_R0805  [R0805]
R78  70  R-US_R0805  [R0805]
R79  70  R-US_R0805  [R0805]
R80  70  R-US_R0805  [R0805]
R81  70  R-US_R0805  [R0805]
R82  70  R-US_R0805  [R0805]
R83  1k  R-US_R0805  [R0805]
R84  6k  R-US_R0805  [R0805]
R85  6k  R-US_R0805  [R0805]
R86  6k  R-US_R0805  [R0805]
R87  6k  R-US_R0805  [R0805]
R88  6k  R-US_R0805  [R0805]
R89  6k  R-US_R0805  [R0805]
R90  10k  R-US_R0805  [R0805]
R91  10k  R-US_R0805  [R0805]
R92  10k  R-US_R0805  [R0805]
R93  10k  R-US_R0805  [R0805]
R94  10k  R-US_R0805  [R0805]
R95  10k  R-US_R0805  [R0805]
R96  6k  R-US_R0805  [R0805]
R97  10k  R-US_R0805  [R0805]
S1  10-XX  [B3F-10XX]
SL1  M06  [06P]
STR_GND  2,54/1,1  [2,54/1,1]
U1  6SLX9TQG144  [TQ144]

## Nets
+1V2: C92.1 C93.1 C94.1 IC29.2(VOUT1) IC29.4(VOUT2) U1.P19(BVCCINT:VCCINT) U1.P28(BVCCINT:VCCINT) U1.P52(BVCCINT:VCCINT) U1.P89(BVCCINT:VCCINT) U1.P128(BVCCINT:VCCINT)
+2V5: C89.1 C90.1 C91.1 IC30.2(VOUT1) IC30.4(VOUT2) U1.P20(BVCCAUX:VCCAUX) U1.P36(BVCCAUX:VCCAUX) U1.P53(BVCCAUX:VCCAUX) U1.P90(BVCCAUX:VCCAUX) U1.P129(BVCCAUX:VCCAUX)
+3V3A: C14.1 C125.1 C132.1 C145.1 C146.+ IC5.14(P:VDD) IC9.8(PWR:VCC) IC14.16(PWR:VCC) IC32.3(VIN) L5.1 L6.1 L7.1 L8.1 L9.1 L10.1 L11.1 L12.1 L13.1 L14.1 L16.1 L18.1 L23.2 L25.1 Q3.1(A:C1) Q3.2(A:C2) Q3.3(B:C1) Q3.4(B:C2) R18.E
+3V3D: C69.1 C80.1 C81.1 C82.1 C83.1 C84.1 C85.1 C86.1 C87.1 C88.1 IC8.2(VOUT1) IC8.4(VOUT2) IC41.18(VCCINT) IC41.19(VCCO) IC41.20(VCCJ) L15.2 L17.2 L19.2 L20.2 L21.2 L22.2 QG1.1(OE) QG1.4(VCC) R58.2 R60.2 R61.2 R62.2 SL1.6 U1.P4(B3:VCCO_3) U1.P18(B3:VCCO_3) U1.P31(B3:VCCO_3) U1.P42(B2:VCCO_2) U1.P63(B2:VCCO_2) U1.P69(B2:IO_L1N_M0_CMPMISO_2) U1.P76(B1:VCCO_1) U1.P86(B1:VCCO_1) U1.P103(B1:VCCO_1) U1.P122(B0:VCCO_0) U1.P125(B0:VCCO_0) U1.P135(B0:VCCO_0)
+5V: C72.+ IC4.1(DIR) IC4.20(VCC) IC8.3(VIN) IC29.3(VIN) IC30.3(VIN) L1.2 R83.1
/RST: R96.1 R97.2 U1.P138(B0:IO_L4P_0)
AGND: C11.2 C12.- C14.2 C27.2 C68.2 C95.2 C96.- C97.2 C98.- C99.2 C100.- C101.2 C102.- C103.2 C104.- C105.2 C106.- C107.2 C108.- C109.2 C110.- C111.2 C112.- C117.2 C118.- C121.2 C122.- C123.2 C125.2 C131.2 C132.2 C145.2 C146.- C147.2 C148.- IC1.4(-VS) IC5.7(P:VSS) IC5.12(D:C) IC9.4(PWR:GND) IC10.4(PWR:GND) IC12.4(-VS) IC13.4(-VS) IC14.8(PWR:GND) IC14.15(CON:/EN) IC17.4(-VS) IC19.4(-VS) IC20.4(-VS) IC21.4(-VS) IC23.4(-VS) IC24.4(-VS) IC25.4(-VS) IC26.4(-VS) IC32.1(GND) IC33.4(-VS) L24.2 Q3.5(C:C) Q3.6(C:C2) Q3.7(D:C) Q3.8(D:C2) R18.A R65.1 R68.1
BRKPT0: R50.1 U1.P67(B2:IO_L2P_CMPCLK_2)
BRKPT1: R51.1 U1.P66(B2:IO_L2N_CMPMOSI_2)
BRKPT2: R52.1 U1.P64(B2:IO_L3N_MOSI_CSI_B_MISO0_2)
BRKPT3: R53.1 U1.P62(B2:IO_L12P_D1_MISO2_2)
BRKPT4: R54.1 U1.P61(B2:IO_L12N_D2_MISO3_2)
BRKPT5: R55.1 U1.P59(B2:IO_L13N_D10_2)
BRKPT6: R56.1 U1.P58(B2:IO_L14P_D11_2)
BRKPT7: R57.1 U1.P57(B2:IO_L14N_D12_2)
CAP_SW1: IC5.13(A:C) U1.P84(B1:IO_L43N_GCLK4_1)
CAP_SW2: IC5.6(C:C) U1.P74(B1:IO_L74N_DOUT_BUSY_1)
CCLK: IC41.3(CLK) R58.1 R59.2 U1.P70(B2:IO_L1P_CCLK_2)
CLK: IC4.11(B8) JP4.6
DATA_READY: JP4.2 R85.1
DIN: IC41.1(DO) U1.P65(B2:IO_L3P_D0_DIN_MISO_MISO1_2)
DONE: IC41.10(/CE) R61.1 U1.P71(B2:DONE_2)
FPGA_IN0: R86.2 R92.1 U1.P115(B0:IO_L65P_SCP3_0)
FPGA_IN1: R87.2 R93.1 U1.P114(B0:IO_L65N_SCP2_0)
FPGA_IN2: R88.2 R94.1 U1.P112(B0:IO_L66P_SCP1_0)
FPGA_IN3: R89.2 R95.1 U1.P111(B0:IO_L66N_SCP0_0)
FPGA_OUT0: IC4.2(A1) U1.P133(B0:IO_L34N_GCLK18_0)
FPGA_OUT1: IC4.3(A2) U1.P132(B0:IO_L35P_GCLK17_0)
FPGA_OUT2: IC4.4(A3) U1.P131(B0:IO_L35N_GCLK16_0)
FPGA_OUT3: IC4.5(A4) U1.P127(B0:IO_L36P_GCLK15_0)
FPGA_OUT4: IC4.6(A5) U1.P126(B0:IO_L36N_GCLK14_0)
GAIN: IC22.12(D:C) U1.P40(B2:IO_L64N_D9_2)
GCLK: QG1.3(FO) U1.P55(B2:IO_L30N_GCLK0_USERCCLK_2)
GND: C13.2 C69.2 C72.- C80.2 C81.2 C82.2 C83.2 C84.2 C85.2 C86.2 C87.2 C88.2 C89.2 C90.2 C91.2 C92.2 C93.2 C94.2 IC4.10(GND) IC4.19(G) IC8.1(GND) IC29.1(GND) IC30.1(GND) IC41.11(GND) JP4.7 JP7.6 JP7.7 L2.2 L26.2 L27.2 L28.2 L29.2 L30.2 L31.2 QG1.2(GND) R59.1 R90.2 R91.2 R92.2 R93.2 R94.2 R95.2 R97.1 S1.1(S) S1.2(S1) SL1.5 U1.P3(BGND:GND) U1.P13(BGND:GND) U1.P25(BGND:GND) U1.P49(BGND:GND) U1.P54(BGND:GND) U1.P60(B2:IO_L13P_M1_2) U1.P68(BGND:GND) U1.P77(BGND:GND) U1.P91(BGND:GND) U1.P96(BGND:GND) U1.P108(BGND:GND) U1.P113(BGND:GND) U1.P130(BGND:GND) U1.P136(BGND:GND) U1.P144(B0:IO_L1P_HSWAPEN_0)
GND_STAR: C70.- C71.- IC6.1(GND) IC28.1(GND) L2.1 L4.1 L24.1 STR_GND.1(P)
GNDA: C29.- C30.2 C31.2 C73.2 C74.2 C76.2 C77.2 C137.2 C138.2 C139.2 C140.2 C141.2 C142.2 C143.2 C144.2 IC2.7(P:VSS) IC3.7(P:VSS) IC3.8(C:A) IC7.6(C:C) IC7.7(P:VSS) IC7.12(D:C) IC16.7(P:VSS) IC18.7(P:VSS) IC22.7(P:VSS) L4.2 L26.1 L27.1 L28.1 L29.1 L30.1 L31.1
HI_RES_PWM1: IC2.12(D:C) IC2.13(A:C) R11.2
HI_RES_PWM1_FPGA: R11.1 U1.P82(B1:IO_L45N_1)
HI_RES_PWM2: IC3.13(A:C) R10.2
HI_RES_PWM2_FPGA: R10.1 U1.P97(B1:IO_L34N_1)
HIGH_FREQ_LPF: IC18.6(C:C) IC18.12(D:C) R79.2
HIGH_FREQ_LPF_FPGA: R79.1 U1.P14(B3:IO_L44N_GCLK20_3)
HIGH_LEVEL: IC22.6(C:C) R80.2
HIGH_LEVEL_FPGA: R80.1 U1.P17(B3:IO_L43P_GCLK23_3)
IN1: JP3.6 R87.1
IN2: JP3.7 R88.1
IN3: JP3.8 R89.1
IN_GAIN: IC3.12(D:C) R9.2
IN_GAIN_FPGA: R9.1 U1.P99(B1:IO_L33N_1)
INIT_B: IC41.8(OE/RESET) R62.1 U1.P39(B2:IO_L65P_INIT_B_2)
LO_RES_PWM: IC2.5(B:C) IC2.6(C:C) R12.2 R72.2
LO_RES_PWM_FPGA: R12.1 U1.P78(B1:IO_L47N_1)
LOW2MID_HPF: IC16.5(B:C) IC16.13(A:C) R76.2
LOW2MID_HPF_FPGA: R76.1 U1.P5(B3:IO_L52N_3)
LOW2MID_LPF: IC7.5(B:C) IC7.13(A:C) R75.2
LOW2MID_LPF_FPGA: R75.1 U1.P1(B3:IO_L83N_VREF_3)
LOW_LEVEL: IC22.13(A:C) R82.2
LOW_LEVEL_FPGA: R82.1 U1.P24(B3:IO_L41P_GCLK27_3)
MID2HIGH_HPF: IC18.5(B:C) IC18.13(A:C) R78.2
MID2HIGH_HPF_FPGA: R78.1 U1.P11(B3:IO_L49N_3)
MID2HIGH_LPF: IC16.6(C:C) IC16.12(D:C) R77.2
MID2HIGH_LPF_FPGA: R77.1 U1.P8(B3:IO_L51P_3)
MID_LEVEL: IC22.5(B:C) R81.2
MID_LEVEL_FPGA: R81.1 U1.P21(B3:IO_L42N_GCLK24_3)
MISO: JP4.5 R84.1
MOSI: IC4.12(B7) JP4.4
N$1: C68.1 IC9.3(A:IN+) R45.2
N$2: IC9.2(A:IN-) R19.1 R65.2
N$4: IC2.4(B:A) R5.2
N$5: IC14.7(B:COM) IC14.12(D:COM)
N$6: C2.1 IC2.2(A:B) IC2.3(B:B) IC5.1(A:A) IC14.14(D:NC)
N$7: IC14.11(C:NC) R63.1
N$8: IC2.11(D:A) R7.2
N$9: IC9.1(A:OUT) Q3.13(B:B)
N$10: C39.1 C42.1 C44.2 C62.2 IC16.8(C:A) IC17.2(IN-) IC17.6(OUT) R30.2 R31.2
N$11: C3.1 IC2.9(C:B) IC2.10(D:B) IC5.9(C:B) IC13.3(IN+) R8.2
N$12: C5.1 C6.2 IC13.2(IN-) IC14.9(C:COM) R64.2 R71.2
N$13: C27.1 IC9.5(B:IN+) R73.2
N$14: IC3.2(A:B) R64.1
N$15: C6.1 R8.1
N$16: C44.1 C45.2 C47.1 IC16.11(D:A) R32.2
N$17: C9.2 IC5.2(A:B)
N$19: C8.1 IC14.10(C:NO)
N$29: IC3.3(B:B) R71.1
N$30: IC16.10(D:B) R33.1
N$32: C11.1 C12.+ IC10.8(PWR:VCC) L14.2
N$33: IC22.2(A:B) R41.1
N$34: IC22.3(B:B) R42.1
N$36: JP2.1 PAD3.1(P)
N$37: IC14.2(A:NC) JP2.2
N$38: C10.1 IC10.1(A:OUT) JP6.1 R14.1
N$39: IC2.8(C:A) R6.2
N$40: IC10.5(B:IN+) R14.2 R15.1
N$41: IC10.7(B:OUT) JP6.3 R15.2 R70.E
N$42: IC9.6(B:IN-) R67.1 R68.2
N$43: R17.1 R18.S
N$44: IC18.2(A:B) R38.1
N$45: C10.2 IC10.2(A:IN-) R16.2 R17.2
N$46: JP2.3 JP6.2
N$47: C7.1 IC5.8(C:A)
N$49: C4.1 C8.2 C9.1 C24.1 IC13.6(OUT) IC14.3(A:NO) JP5.1 PAD4.1(P) R63.2
N$50: C1.1 C2.2 C123.1 IC3.10(D:B) IC5.3(B:B) IC12.6(OUT) IC14.13(D:NO) R5.1 R66.1
N$51: C95.1 C96.+ IC1.7(+VS) L5.2
N$52: IC18.3(B:B) R39.1
N$54: C97.1 C98.+ IC26.7(+VS) L6.2
N$55: C99.1 C100.+ IC24.7(+VS) L7.2
N$56: C101.1 C102.+ IC17.7(+VS) L8.2
N$57: C103.1 C104.+ IC19.7(+VS) L9.2
N$58: C105.1 C106.+ IC20.7(+VS) L10.2
N$59: C107.1 C108.+ IC25.7(+VS) L11.2
N$60: C109.1 C110.+ IC23.7(+VS) L12.2
N$61: C111.1 C112.+ IC21.7(+VS) L13.2
N$62: IC14.4(A:COM) R1.1
N$64: C117.1 C118.+ IC12.7(+VS) L16.2
N$65: C1.2 IC12.2(IN-) R1.2 R4.1
N$66: C121.1 C122.+ IC13.7(+VS) L18.2
N$67: C13.1 JP7.3 R83.2 R96.2 S1.3(P) S1.4(P1)
N$68: IC14.6(B:NO) Q3.11(C:B) Q3.15(A:B)
N$69: IC7.2(A:B) R26.1
N$70: C32.1 C33.2 C35.1 IC7.4(B:A) R26.2
N$71: C38.1 C41.2 C62.1 IC17.3(IN+) R29.2
N$72: C147.1 C148.+ IC33.7(+VS) L25.2
N$73: IC16.9(C:B) R32.1
N$74: C37.1 R28.1
N$75: IC7.3(B:B) R27.1
N$76: C33.1 C34.1 C64.1 IC1.3(IN+) R27.2
N$77: IC18.9(C:B) R35.1
N$78: IC16.2(A:B) R29.1
N$79: C35.2 C36.1 C50.2 C64.2 IC1.2(IN-) IC1.6(OUT) IC22.1(A:A) R28.2
N$80: C39.2 C40.2 C41.1 IC16.4(B:A)
N$81: C57.2 C58.2 C59.1 IC18.4(B:A)
N$82: IC18.10(D:B) R36.1
N$83: IC16.3(B:B) R30.1
N$84: IC12.3(IN+) R2.2 R3.1
N$85: C136.2 IC22.11(D:A) IC33.2(IN-) Q1.1(A:C1) Q1.2(A:C2) Q1.3(B:C1) Q1.4(B:C2) Q1.5(C:C1) Q1.6(C:C2) Q1.7(D:C1) Q1.8(D:C2) Q2.1(A:C) Q2.2(A:C2) Q2.3(B:C) Q2.4(B:C2) Q2.5(C:C) Q2.6(C:C2) Q2.7(D:C) Q2.8(D:C2) R20.2
N$86: C43.1 R31.1
N$87: R16.1 R70.S
N$88: IC22.10(D:B) R21.1
N$89: Q1.16(A:E) R22.1
N$90: C57.1 C60.1 C63.2 C133.2 IC18.8(C:A) IC23.2(IN-) IC23.6(OUT) R39.2 R40.2
N$91: Q1.14(B:E) R23.1
N$92: Q1.12(C:E) R24.1
N$93: C45.1 C46.1 C65.1 IC19.3(IN+) R33.2
N$94: C47.2 C48.1 C51.2 C65.2 IC19.2(IN-) IC19.6(OUT) IC22.4(B:A) R34.2
N$95: C49.1 R34.1
N$96: Q1.10(D:E) R25.1
N$97: C50.1 C51.1 C66.1 C67.2 IC20.2(IN-) R41.2 R42.2 R43.2 R44.1
N$98: C53.1 C133.1 C134.2 IC18.11(D:A) R35.2
N$99: C61.1 R40.1
N$100: Q2.16(A:E) R46.2
N$101: IC22.9(C:B) R43.1
N$102: C52.1 C134.1 C135.1 IC21.3(IN+) R36.2
N$103: C53.2 C54.1 C66.2 C135.2 IC21.2(IN-) IC21.6(OUT) IC22.8(C:A) R37.2
N$104: C55.1 R37.1
N$105: Q2.14(B:E) R47.2
N$106: C56.1 C59.2 C63.1 IC23.3(IN+) R38.2
N$107: C67.1 IC20.6(OUT) R20.1 R44.2
N$108: C40.1 IC24.2(IN-) IC24.6(OUT)
N$109: C58.1 IC25.2(IN-) IC25.6(OUT)
N$110: IC26.3(IN+) JP5.2
N$111: JP5.3 PAD1.1(P)
N$112: C32.2 IC7.1(A:A) IC24.3(IN+) IC25.3(IN+) IC26.2(IN-) IC26.6(OUT)
N$113: IC5.4(B:A) R3.2
N$114: IC9.7(B:OUT) Q3.9(D:B)
N$115: JP3.5 R86.1
N$116: IC3.11(D:A) R4.2
N$117: IC6.3(VIN) IC28.3(VIN) JP7.8 PWR.1(P)
N$118: Q2.12(C:E) R48.2
N$119: IC3.5(B:C) IC3.9(C:B) R72.1
N$121: Q2.10(D:E) R49.2
N$123: C136.1 IC33.6(OUT) PAD2.1(P) R21.2 R22.2 R23.2 R24.2 R25.2 R46.1 R47.1 R48.1 R49.1
N$124: C137.1 Q1.15(A:B) R50.2
N$125: C138.1 Q1.13(B:B) R51.2
N$126: C139.1 Q1.11(C:B) R52.2
N$127: C140.1 Q1.9(D:B) R53.2
N$128: C141.1 Q2.15(A:B) R54.2
N$129: C142.1 Q2.13(B:B) R55.2
N$130: C143.1 Q2.11(C:B) R56.2
N$131: C144.1 Q2.9(D:B) R57.2
N$133: IC2.1(A:A) R66.2
N$137: C24.2 R69.2
N$209: IC41.4(TDI) SL1.2
NEW_DATA: R85.2 R91.1 U1.P116(B0:IO_L64N_SCP4_0)
NFILTER_OSC_SEL: IC3.6(C:C) IC5.5(B:C) IC14.1(CON:IN) U1.P94(B1:IO_L40N_GCLK10_1)
OUT0: IC4.18(B1) JP3.1
OUT1: IC4.17(B2) JP3.2
OUT2: IC4.16(B3) JP3.3
OUT3: IC4.15(B4) JP3.4
OUT4: IC4.14(B5) JP4.1
PROGRAM_B: IC41.7(/CF) R60.1 U1.P37(B2:PROGRAM_B_2)
PULSE_HI_LIMIT: R73.1 R74.2
PULSE_HI_LIMIT_FPGA: R74.1 U1.P87(B1:IO_L42N_GCLK6_TRDY1_1)
PULSE_LO_LIMIT: R13.2 R45.1
PULSE_LO_LIMIT_FPGA: R13.1 U1.P92(B1:IO_L41N_GCLK8_1)
PULSE_OUT: C3.2 IC14.5(B:NC) Q3.10(D:E) Q3.12(C:E) Q3.14(B:E) Q3.16(A:E) R6.1 R7.1 R19.2 R67.2 U1.P80(B1:IO_L46N_1)
PWR_DIG: C70.+ IC6.2(VOUT1) IC6.4(VOUT2) L1.1
PWR_STAR: C71.+ IC28.2(VOUT1) IC28.4(VOUT2) L3.1 L23.1
SPI_CLK: IC4.9(A8) U1.P120(B0:IO_L62N_VREF_0)
SPI_MISO: R84.2 R90.1 U1.P117(B0:IO_L64P_SCP5_0)
SPI_MOSI: IC4.8(A7) U1.P123(B0:IO_L37N_GCLK12_0)
SPI_SS: IC4.7(A6) U1.P124(B0:IO_L37P_GCLK13_0)
SS: IC4.13(B6) JP4.3
TCK: IC41.6(TCK) SL1.4 U1.P109(BNA:TCK)
TDI: IC41.17(TDO) U1.P110(BNA:TDI)
TDO: SL1.3 U1.P106(BNA:TDO)
TMS: IC41.5(TMS) SL1.1 U1.P107(BNA:TMS)
VCC: C29.+ C30.1 C31.1 C73.1 C74.1 C76.1 C77.1 IC2.14(P:VDD) IC3.14(P:VDD) IC7.14(P:VDD) IC16.14(P:VDD) IC18.14(P:VDD) IC22.14(P:VDD) L3.2 L15.1 L17.1 L19.1 L20.1 L21.1 L22.1
VMID: C4.2 C5.2 C7.2 C34.2 C36.2 C37.2 C38.2 C42.2 C43.2 C46.2 C48.2 C49.2 C52.2 C54.2 C55.2 C56.2 C60.2 C61.2 C131.1 IC3.1(A:A) IC3.4(B:A) IC10.3(A:IN+) IC10.6(B:IN-) IC16.1(A:A) IC18.1(A:A) IC20.3(IN+) IC32.2(VOUT1) IC32.4(VOUT2) IC33.3(IN+) R2.1 R69.1
Unconnected: IC5.10(D:B) IC5.11(D:A) IC7.8(C:A) IC7.9(C:B) IC7.10(D:B) IC7.11(D:A) IC41.2(NC1) IC41.9(NC2) IC41.12(NC3) IC41.13(/CEO) IC41.14(NC4) IC41.15(NC5) IC41.16(NC6) JP1.1 JP1.2 JP1.3 JP1.4 JP1.5 JP1.6 JP4.8 JP4.9 JP4.10 JP7.1 JP7.2 JP7.4 JP7.5 R70.A U1.P2(B3:IO_L83P_3) U1.P6(B3:IO_L52P_3) U1.P7(B3:IO_L51N_3) U1.P9(B3:IO_L50N_3) U1.P10(B3:IO_L50P_3) U1.P12(B3:IO_L49P_3) U1.P15(B3:IO_L44P_GCLK21_3) U1.P16(B3:IO_L43N_GCLK22_IRDY2_3) U1.P22(B3:IO_L42P_GCLK25_TRDY2_3) U1.P23(B3:IO_L41N_GCLK26_3) U1.P26(B3:IO_L37N_3) U1.P27(B3:IO_L37P_3) U1.P29(B3:IO_L36N_3) U1.P30(B3:IO_L36P_3) U1.P32(B3:IO_L2N_3) U1.P33(B3:IO_L2P_3) U1.P34(B3:IO_L1N_VREF_3) U1.P35(B3:IO_L1P_3) U1.P38(B2:IO_L65N_CSO_B_2) U1.P41(B2:IO_L64P_D8_2) U1.P43(B2:IO_L62N_D6_2) U1.P44(B2:IO_L62P_D5_2) U1.P45(B2:IO_L49N_D4_2) U1.P46(B2:IO_L49P_D3_2) U1.P47(B2:IO_L48N_RDWR_B_VREF_2) U1.P48(B2:IO_L48P_D7_2) U1.P50(B2:IO_L31N_GCLK30_D15_2) U1.P51(B2:IO_L31P_GCLK31_D14_2) U1.P56(B2:IO_L30P_GCLK1_D13_2) U1.P72(B2:CMPCS_B_2) U1.P73(BNA:SUSPEND) U1.P75(B1:IO_L74P_AWAKE_1) U1.P79(B1:IO_L47P_1) U1.P81(B1:IO_L46P_1) U1.P83(B1:IO_L45P_1) U1.P85(B1:IO_L43P_GCLK5_1) U1.P88(B1:IO_L42P_GCLK7_1) U1.P93(B1:IO_L41P_GCLK9_IRDY1_1) U1.P95(B1:IO_L40P_GCLK11_1) U1.P98(B1:IO_L34P_1) U1.P100(B1:IO_L33P_1) U1.P101(B1:IO_L32N_1) U1.P102(B1:IO_L32P_1) U1.P104(B1:IO_L1N_VREF_1) U1.P105(B1:IO_L1P_1) U1.P118(B0:IO_L63N_SCP6_0) U1.P119(B0:IO_L63P_SCP7_0) U1.P121(B0:IO_L62P_0) U1.P134(B0:IO_L34P_GCLK19_0) U1.P137(B0:IO_L4N_0) U1.P139(B0:IO_L3N_0) U1.P140(B0:IO_L3P_0) U1.P141(B0:IO_L2N_0) U1.P142(B0:IO_L2P_0) U1.P143(B0:IO_L1N_VREF_0)

## Buses
BRKPT[0..7],GAIN
LOW2MID_LPF,LOW2MID_HPF,LOW_LEVEL,MID2HIGH_HPF,MID2HIGH_LPF,MID_LEVEL,HIGH_FREQ_LPF,HIGH_LEVEL
IN_GAIN,NFILTER_OSC_SEL,PULSE_OUT,HI_RES_PWM[1..2],LO_RES_PWM,PULSE_HI_LIMIT,PULSE_LO_LIMIT,CAP_SW[1..2]
SPI_CLK,SPI_MISO,SPI_MOSI,SPI_SS,NEW_DATA,FPGA_IN[0..3],FPGA_OUT[0..4]

## Notes on the sheet
- +3V3A: analog power plane
  VCC: switch power plane
  +3V3D: digital power plane
- Characteristic Impedance of digital traces: 70 ohms.
  Use 50 or 70 ohm resistor for series termination on FPGA lines.
- 5V | 3.3V
- PROTECTION FOR MAIN BOARD:
  Even if Arduino is power up via the USB
  port, the MCU will be held in reset, as
  the reset line will be held low by the 
  unpowered (0 volts) +5V line through
  R83.
- IN3
- IN2
- LOW2MID_LPF
- IN1
- IN0
- DATA_READY | LOW_LEVEL
- /RST
- MISO
- LOW2MID_HPF
- SPI_CLK
- DATA_READY
- SPI_MISO
- IN1
- IN0
- IN3
- IN2
- OUT0
- OUT2
- OUT1
- OUT4
- OUT3
- SPI_MOSI
- SPI_SS
- IN_GAIN
- HI_RES_PWM2
- HI_RES_PWM1
- PULSE_OUT
- LO_RES_PWM
- CAP_SW2
- PULSE_LO_LIMIT
- CAP_SW1
- NFILTER_OSC_SEL
- PULSE_HI_LIMIT
- MID2HIGH_LPF
- MID_LEVEL
- MID2HIGH_HPF
- HIGH_FREQ_LPF
- MID2HIGH_HPF
- MID2HIGH_LPF | HIGH_LEVEL
- LOW2MID_HPF
- LOW2MID_LPF
- LOW_LEVEL
- MID_LEVEL
- HIGH_LEVEL
- HIGH_FREQ_LPF

## Library data of the parts
C1-C11 C13 C14 C24 C27 C30-C69 C73 C74 C76 C77 C80-C95 C97 C99 C101 C103 C105 C107 C109 C111 C117 C121 C123 C125 C131-C145 C147 = rcl:C-US: CAPACITOR, American symbol
C12 C29 C70-C72 C96 C98 C100 C102 C104 C106 C108 C110 C112 C118 C122 C146 C148 = rcl:CPOL-US: POLARIZED CAPACITOR, American symbol
IC1 IC12 IC13 IC17 IC19-IC21 IC23-IC26 IC33 = analog-devices:AD8031: 2.7 V, 800 ?A, 80 MHz Rail-to-Rail I/O Amplifiers Source: http://www.analog.com/static/imported-files/data_sheets/AD8031_8032.pdf; MPN: AD8031BNZ; OC_FARNELL: 1438575; OC_NEWARK: 15P0920
IC2 IC3 IC5 IC7 IC16 IC18 IC22 = 40xx:4066: Quad bilateral ANALOG SWITCH
IC4 = 74xx-us:74*245: Octal BUS TRANSCEIVER, 3-state
IC6 IC28 = texas2:TLV1117
IC8 IC29 IC30 IC32 = texas:TLV1117
IC9 IC10 = texas2:TLV2772
IC14 = diodesinc:PI5A100
IC41 = xilinx_spartan3_virtex4_and_5:XCFXXS
JP1 = arduino_jw:ARDUINO_CONN-ANALOG: Arduino Analog I/O Header This is the analog I/O header on the Arduino Uno R3. This connector is labeled with the following pin assignments: Analog 0 Analog 1 Analog 2 Analog 3 Analog 4 Analog 5 NOTE: Be sure you install this connector with the correct orientation on your PCB layout. Pin 1 has a square pad to assist with orientation.
JP2 JP5 JP6 = jumper:JP2E: JUMPER
JP3 = arduino_jw:ARDUINO_CONN-IO_L: Arduino Digital I/O [Low Byte] Header This is the Digital I/O [low byte] header on the Arduino Uno R3. This connector is labeled with the following pin assignments: Digital 0, Serial Rx Digital 1, Serial Tx Digital 2 Digital 4 Digital 5 [PWM] Digital 6 [PWM] Digital 7 NOTE: Be sure you install this connector with the correct orientation on your PCB layout. Pin 1 has a square pad to assist with orientation.
JP4 = arduino_jw:ARDUINO_CONN-IO_H: Arduino Digital I/O [High Byte] Header This is the Digital I/O [high byte] header on the Arduino Uno R3. This connector is labeled with the following pin assignments: Digital 8 Digital 9 [PWM] Digital 10 [PWM] Digital 11 [PWM] Digital 12 Digital 13 GND AREF SDA SCL NOTE: Be sure you install this connector with the correct orientation on your PCB layout. Pin 1 has a square pad to assist with orientation.
JP7 = arduino_jw:ARDUINO_CONN-POWER: Arduino Power Header This is the power header on the Arduino Uno R3. This connector is labeled with the following pin assignments: n/c IO Ref RESET +3.3V +5V GND GND VIN NOTE: Be sure you install this connector with the correct orientation on your PCB layout. Pin 1 has a square pad to assist with orientation.
L1-L31 = rcl:L-US: INDUCTOR, American symbol
PAD1-PAD4 PWR STR_GND = wirepad:2,54/1,1: THROUGH-HOLE PAD
Q1 = transistor:MMPQ2222A
Q2 = transistor:MMPQ2907A
Q3 = transistor:MMPQ6502
QG1 = crystal:SG-615: SOJ HIGH-FREQUENCY CRYSTAL OSCILLATOR Source: Crystal Oscillator SG-615%20Series.pdf; MPN: SG615P-50MHZ 50PPM; OC_FARNELL: 1216207; OC_NEWARK: 01M8855
R1-R17 R19-R69 R71-R97 = rcl:R-US_: RESISTOR, American symbol
R18 R70 = pot:TRIM_US-: POTENTIOMETER
S1 = switch-omron:10-XX: OMRON SWITCH; MPN: B3F-1000; OC_FARNELL: 176432; OC_NEWARK: 36M3542
SL1 = con-amp-quick:M06: AMP QUICK CONNECTOR; OC_FARNELL: unknown; OC_NEWARK: unknown
U1 = xilinx_devices:6SLX9TQG144: Xilinx FPGA: 6slx9tqg144